# EasyEDA Pro project ProProject_FAB-O-MATIC _ a FabLab machine access control with RFID cards_2024-06-24.epro

# Schematic FAB-O-MATIC

## Sheets
1 Schematics
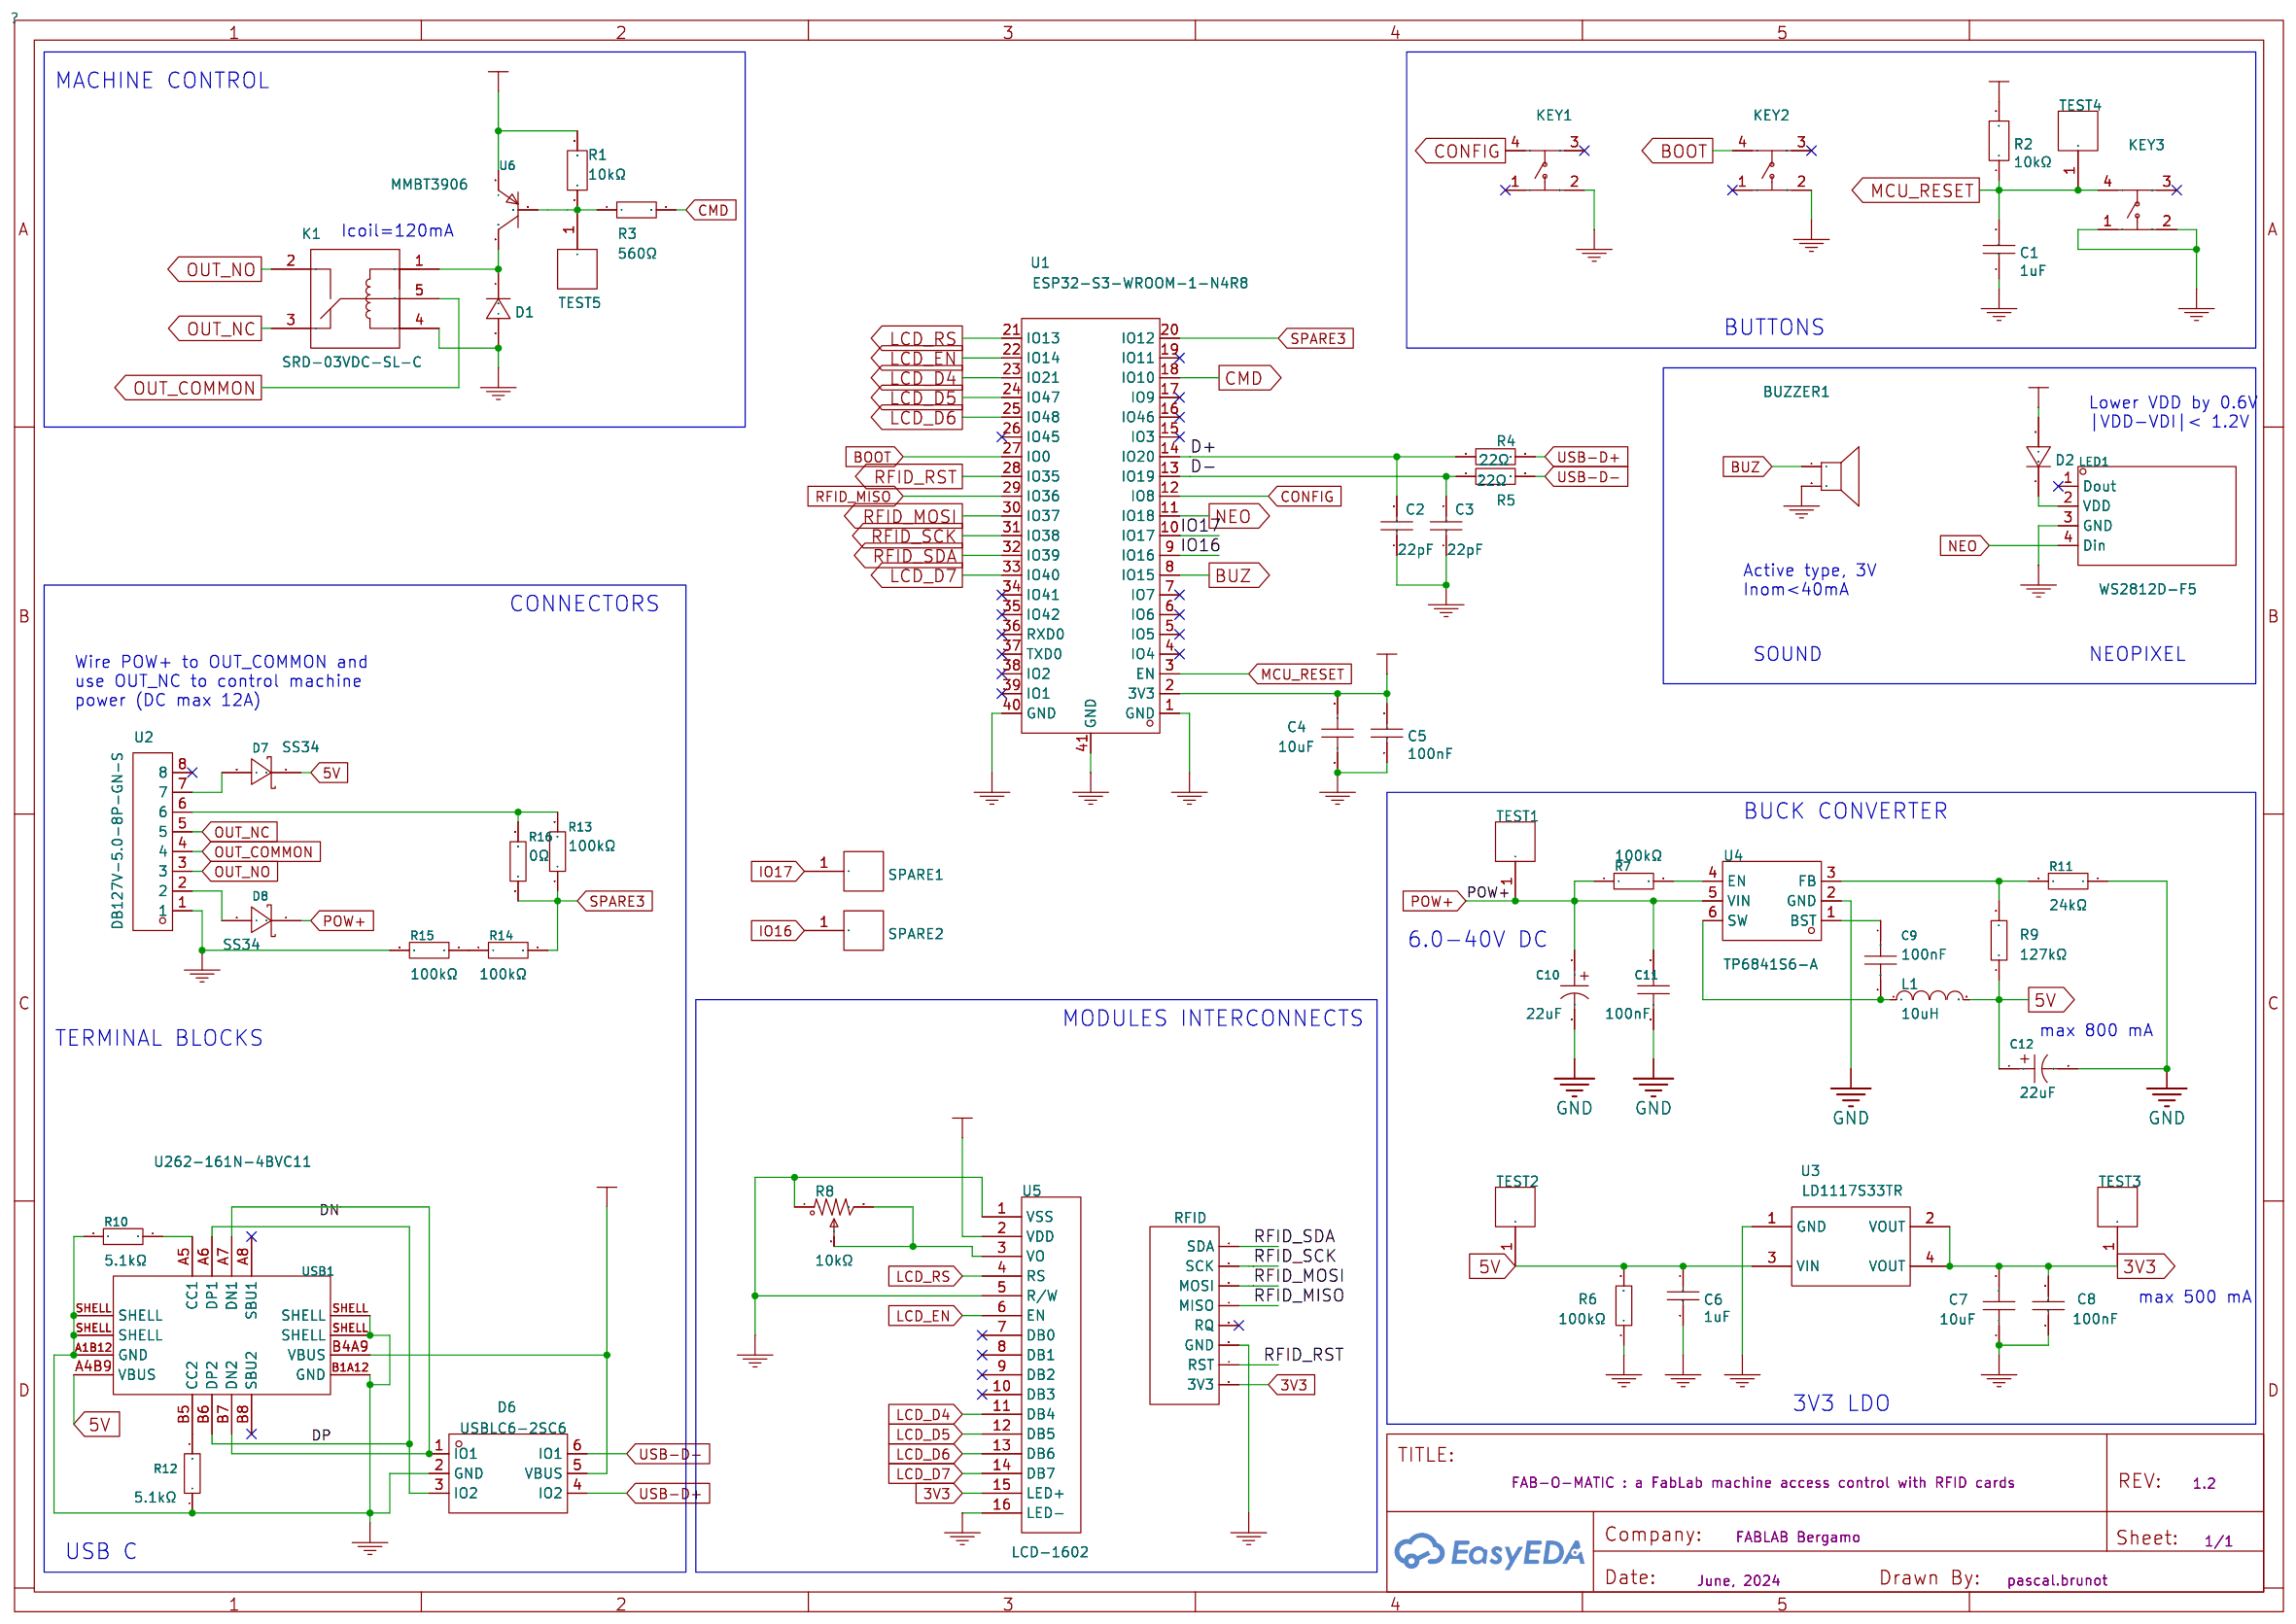
[diagram p0: Schematics]
2 Notes: Create Date: 2024-05-12; Page Name: Notes; Project Name: FAB-O-MATIC : a FabLab machine access control with RFID cards; Schematic Name: FAB-O-MATIC; Update Date: 2024-05-19; Company: FabLab BG; Drawn: PBrunot; Page Size: A4; Part Number: JLCPCB-002; Version: V0.1
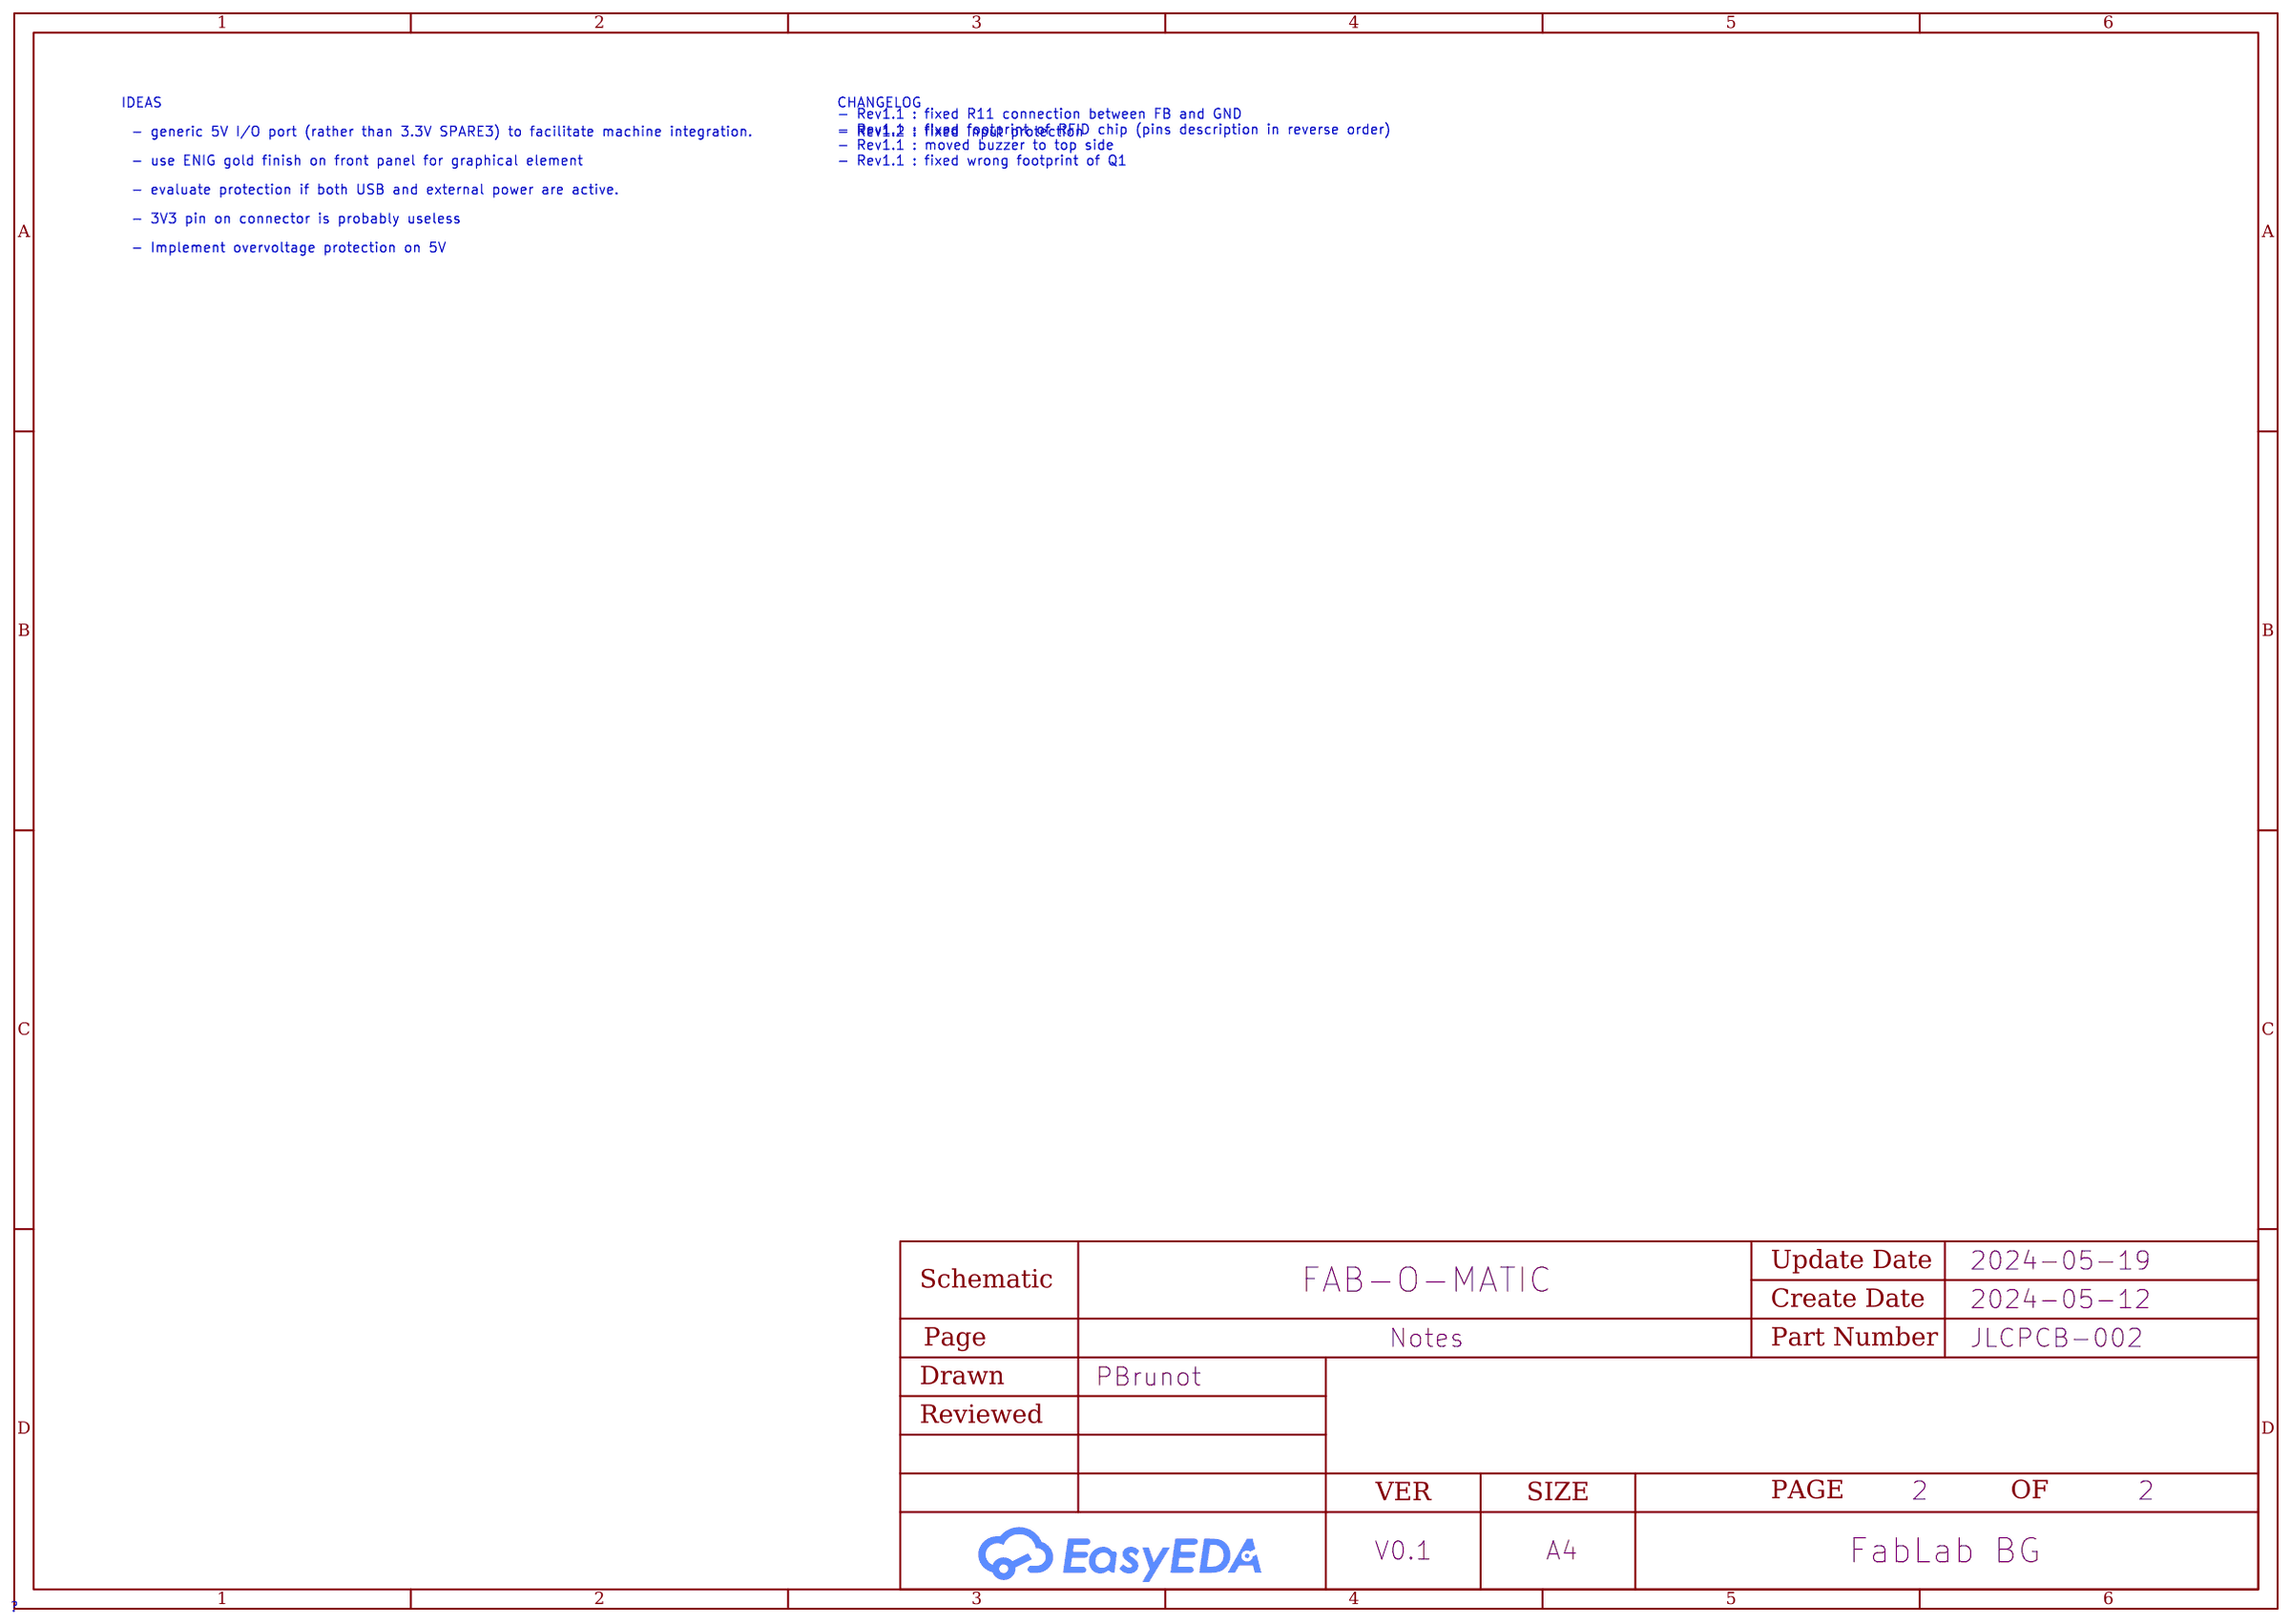
[diagram p1: Notes]

## Parts
BUZZER1  4kHz  [BUZ-TH_BD12.5-P6.50-D0.9]
C1  1uF  [C0805]
C2  22pF  [C0603]
C3  22pF  [C0603]
C4  10uF  [C0805]
C5  100nF  [C0805]
C6  1uF  [C0805]
C7  10uF  [C0805]
C8  100nF  [C0805]
C9  100nF  [C0603]
C10  22uF  [CAP-SMD_BD6.3-L6.6-W6.6-FD]
C11  100nF  [C0603]
C12  22uF  [CAP-SMD_BD6.3-L6.6-W6.6-FD]
D1  SM4007PL  [SOD-123F_L2.8-W1.8-LS3.7-RD]
D2  SM4007PL  [SOD-123F_L2.8-W1.8-LS3.7-RD]
D6  USBLC6-2SC6  [SOT-23-6_L2.9-W1.6-P0.95-LS2.8-BL]
D7  SS34  [SMA_L4.3-W2.6-LS5.2-RD]
D8  SS34  [SMA_L4.3-W2.6-LS5.2-RD]
K1  SRD-03VDC-SL-C  [RELAY-TH_SRD-03VDC-SL-C]
KEY1  TSA063G60-250  [KEY-SMD_4P-L6.1-W6.1-P4.50-LS9.0]
KEY2  TSA063G60-250  [KEY-SMD_4P-L6.1-W6.1-P4.50-LS9.0]
KEY3  TSA063G60-250  [KEY-SMD_4P-L6.1-W6.1-P4.50-LS9.0]
L1  10uH  [IND-SMD_L4.0-W4.0]
LED1  WS2812D-F5  [LED-TH_4P-BD5.8-P1.30]
P1  RFID  [footprint_17af]
R1  10kΩ  [R0805]
R2  10kΩ  [R0805]
R3  560Ω  [R0805]
R4  22Ω  [R0603]
R5  22Ω  [R0603]
R6  100kΩ  [R0805]
R7  100kΩ  [R0603]
R8  10kΩ  [RES-ADJ-TH_3362P]
R9  127kΩ  [R0603]
R10  5.1kΩ  [R0603]
R11  24kΩ  [R0603]
R12  5.1kΩ  [R0603]
R13  100kΩ  [R0603]
R14  100kΩ  [R0603]
R15  100kΩ  [R0603]
R16  0Ω  [R1206]
SPARE1  0577-0-43-80-21-27-10-0  [footprint_662d]  (no BOM)
SPARE2  0577-0-43-80-21-27-10-0  [footprint_662d]  (no BOM)
TEST1  0577-0-43-80-21-27-10-0  [footprint_662d]  (no BOM)
TEST2  0577-0-43-80-21-27-10-0  [footprint_662d]  (no BOM)
TEST3  0577-0-43-80-21-27-10-0  [footprint_662d]  (no BOM)
TEST4  0577-0-43-80-21-27-10-0  [footprint_662d]  (no BOM)
TEST5  0577-0-43-80-21-27-10-0  [footprint_662d]  (no BOM)
U1  ESP32-S3-WROOM-1-N4R8  [WIRELM-SMD_ESP32-S3-WROOM-1]
U2  DB127V-5.0-8P-GN-S  [CONN-TH_8P-P5.00_DB127V-5.0-8P-GN-S]
U3  LD1117S33TR  [SOT-223_L6.5-W3.5-P2.30-LS7.0-BR]
U4  TP6841S6-A  [SOT-23-6_L2.9-W1.6-P0.95-LS2.8-BL]
U5  LCD-1602  [footprint_8a57]
U6  MMBT3906  [SOT-23-3_L2.9-W1.3-P1.90-LS2.4-BR]
USB1  U262-161N-4BVC11  [USB-3.1-SMD_U262-161N-4BVC11]

## Library data of the parts
BUZZER1 = SFN-12055PA6.5_C360607: Oscillator Circuit:无源(外部驱动) Technology Type:压电式 Frequency:4kHz Sound Pressure Level (SPL):80dB@5V,10cm Diameter (φD):12.5mm Height:6mm; LCSC Part Name: 压电无源蜂鸣器; Supplier Part: C360607; Manufacturer: S&S(海旭); Manufacturer Part: SFN-12055PA6.5; Supplier Footprint: 插件,D=12.5mm; JLCPCB Part Class: Extended Part; Datasheet: https://atta.szlcsc.com/upload/public/pdf/source/20220225/D801AF3A55A67CFB490E002F7E7725D1.pdf; Supplier: LCSC; Oscillator Circuit: 无源(外部驱动); Technology Type: 压电式; Sound Pressure Level (SPL): 80dB@5V,10cm; Diameter (φD): 12.5mm; Height: 6mm
C1 C6 = CL21B105KBFNNNE: Capacitance: Tolerance:±10% Tolerance:±10% Voltage Rated: Temperature Coefficient:; LCSC Part Name: 1uF ±10% 50V; Supplier Part: C28323; Manufacturer: SAMSUNG(三星); Supplier Footprint: 0805; JLCPCB Part Class: Basic Part; Datasheet: https://atta.szlcsc.com/upload/public/pdf/source/20160218/1457707763339.pdf; Supplier: LCSC; Tolerance: ±10%
C2 C3 = CL10C220JB8NNNC: Capacitance: Tolerance:±5% Tolerance:±5% Voltage Rated: Temperature Coefficient:; LCSC Part Name: 22pF ±5% 50V; Supplier Part: C1653; Manufacturer: SAMSUNG(三星); Supplier Footprint: 0603; JLCPCB Part Class: Basic Part; Datasheet: https://atta.szlcsc.com/upload/public/pdf/source/20160218/1457707763339.pdf; Supplier: LCSC; Tolerance: ±5%
C4 C7 = GRM21BR61H106KE43L: Capacitance: Tolerance:±10% Tolerance:±10% Voltage Rated: Temperature Coefficient:; LCSC Part Name: 10uF ±10% 50V; Supplier Part: C440198; Manufacturer: muRata(村田); Supplier Footprint: 0805; JLCPCB Part Class: Basic Part; Datasheet: https://atta.szlcsc.com/upload/public/pdf/source/20230811/95AAE0C9AF55EDC31B7A4D8B733F534E.pdf; Supplier: LCSC; Tolerance: ±10%
C5 C8 = CL21B104KCFNNNE: Capacitance: Tolerance:±10% Tolerance:±10% Voltage Rated: Temperature Coefficient:; LCSC Part Name: 100nF ±10% 100V; Supplier Part: C28233; Manufacturer: SAMSUNG(三星); Supplier Footprint: 0805; JLCPCB Part Class: Basic Part; Datasheet: https://atta.szlcsc.com/upload/public/pdf/source/20160218/1457707763339.pdf; Supplier: LCSC; Tolerance: ±10%
C9 C11 = CC0603KRX7R9BB104: Capacitance: Tolerance:±10% Tolerance:±10% Voltage Rated: Temperature Coefficient:; LCSC Part Name: 100nF ±10% 50V; Supplier Part: C14663; Manufacturer: YAGEO(国巨); Supplier Footprint: 0603; JLCPCB Part Class: Basic Part; Datasheet: https://atta.szlcsc.com/upload/public/pdf/source/20180910/C282072_33301C7F631E79921B82A8DAC6BCC5B3.pdf; Supplier: LCSC; Tolerance: ±10%
C10 C12 = RVT22UF50V67RV0028: Capacitance: Tolerance:±20% Tolerance:±20% Rated Voltage: Ripple Current:43mA@120Hz Equivalent Series Resistance(ESR):- φD: L: Lifetime @ Temp:2000hrs@105℃ Operating Temperature:-55℃~+105℃ Operating Temperature:-55℃~+105℃; LCSC Part Name: 22uF ±20% 50V; Supplier Part: C2836438; Manufacturer: KNSCHA(科尼盛); Supplier Footprint: SMD,D6.3xL5.4mm; JLCPCB Part Class: Extended Part; Datasheet: https://atta.szlcsc.com/upload/public/pdf/source/20210528/C2836438_BFA13B3627CC6B20ADD0B3BB98082A71.pdf; Supplier: LCSC; Tolerance: ±20%; Ripple Current: 43mA@120Hz; Lifetime @ Temp: 2000hrs@105℃; Operating Temperature: -55℃~+105℃
D1 D2 = SM4007PL_C64898: Diode Configuration: Forward Voltage (Vf@If):1.1V@1A Reverse Voltage (Vr): Average Rectified Current (Io): Reverse Leakage Current:10uA@1kV; LCSC Part Name: 电压:1kV 电流:1A; Supplier Part: C64898; Manufacturer: MDD; Supplier Footprint: SOD-123FL; JLCPCB Part Class: Basic Part; Datasheet: https://atta.szlcsc.com/upload/public/pdf/source/20230823/16A8FDE162764C9B685A3717F2DA3690.pdf; Supplier: LCSC; Forward Voltage (Vf@If): 1.1V@1A; Reverse Leakage Current: 10uA@1kV
D6 = USBLC6-2SC6_C2827654: polarity:- Reverse Stand-Off Voltage (Vrwm):- Maximum Clamping Voltage:- Peak Pulse Current (Ipp)@10/1000us:- Peak Pulse Power Dissipation (Ppp)@10/1000us:- Breakdown Voltage:- Reverse Leakage Current (Ir):- Operating Temperature:- Operating Temperature:-; LCSC Part Name: ESD，可防30kV静电; Supplier Part: C2827654; Manufacturer: TECH PUBLIC(台舟); Supplier Footprint: SOT-23-6; JLCPCB Part Class: Extended Part; Datasheet: https://atta.szlcsc.com/upload/public/pdf/source/20210810/FBD75DE717D6D97BAC6DD7F2B5C09DCD.pdf; Supplier: LCSC; Type: ESD
D7 D8 = SS34_C8678: Diode Configuration:Single Forward Voltage (Vf@If):550mV@3A Reverse Voltage (Vr):40V Average Rectified Current (Io):3A Reverse Leakage Current (Ir):500uA@40V; LCSC Part Name: 电压:40V 电流:3A; Supplier Part: C8678; Manufacturer: MDD; Supplier Footprint: SMA(DO-214AC); JLCPCB Part Class: Basic Part; Datasheet: https://atta.szlcsc.com/upload/public/pdf/source/20230314/A80AE34493C69B89E2F4B1712F433538.pdf; Supplier: LCSC; Diode Configuration: Single; Forward Voltage (Vf@If): 550mV@3A; Reverse Voltage (Vr): 40V; Average Rectified Current (Io): 3A; Reverse Leakage Current (Ir): 500uA@40V
K1 = SRD-03VDC-SL-C: Coil Voltage:3V Contact Form:一组转换:1C(SPDT-转换) Pin Number:5 Contact Rating:- Maximum Switching Voltage:250V@AC Coil Rated Power:360mW Maximum Switching Current:15A Coil Type:无极性-单线圈 Contact Resistance:100mΩ Operate Time:10ms Release Time:10ms; LCSC Part Name: 3V继电器 单刀双掷 蓝色; Supplier Part: C496430; Manufacturer: 松乐; Supplier Footprint: 插件,15.6x19.2mm; JLCPCB Part Class: Extended Part; Datasheet: https://atta.szlcsc.com/upload/public/pdf/source/20211029/0AF1F09028F3938DCCE87F54F358E4BA.pdf; Supplier: LCSC; Coil Voltage: 3V; Contact Form: 一组转换:1C(SPDT-转换); Pin Number: 5; Maximum Switching Voltage: 250V@AC; Coil Rated Power: 360mW; Maximum Switching Current: 15A; Coil Type: 无极性-单线圈; Contact Resistance: 100mΩ; Operate Time: 10ms; Release Time: 10ms
KEY1-KEY3 = TSA063G60-250: Circuit:SPST Actuator Style:Round Button Operating Force:250gf Mounting Style:Brick nogging Switch Length:6.1mm Switch Width:6.1mm Switch Height:6mm Strike Gundam:不带 Contact Current:50mA Voltage Rating (DC):12V Insulation Resistance:100MΩ Actuator/Cap Col; LCSC Part Name: 6.1*6.1*6mm 立贴 轻触开关; Supplier Part: C294566; Manufacturer: BRIGHT(博瑞泰); Supplier Footprint: SMD; JLCPCB Part Class: Extended Part; Datasheet: https://atta.szlcsc.com/upload/public/pdf/source/20181029/C294570_15EFF1F4D215547575AD6307D8A439BB.pdf; Supplier: LCSC; Circuit: SPST; Actuator Style: Round Button; Operating Force: 250gf; Mounting Style: Brick nogging; Switch Length: 6.1mm; Switch Width: 6.1mm; Switch Height: 6mm; Strike Gundam: 不带; Contact Current: 50mA; Voltage Rating (DC): 12V; Insulation Resistance: 100MΩ; Actuator/Cap Color: Black; With Lamp: No; Pin Style: Gull Wing; Mechanical Life: 5万次; Operating Temperature: -25℃~+70℃
L1 = SWPA4030S100MT: Inductance: Tolerance:±20% Tolerance:±20% Rated Current: Saturation Current (Isat):2.4A DC Resistance (DCR): Type:- Ratings:-; LCSC Part Name: 10uH ±20% 2.4A; Supplier Part: C38117; Manufacturer: Sunlord(顺络); Supplier Footprint: SMD; JLCPCB Part Class: Extended Part; Datasheet: https://atta.szlcsc.com/upload/public/pdf/source/20231024/317626D2AA2F8AB4113C1875E432E6E1.pdf; Supplier: LCSC; Tolerance: ±20%; Saturation Current (Isat): 2.4A
LED1 = WS2812D-F5: Lamp Holder Type:5mm圆形灯头; Supplier Part: C190565; Manufacturer: worldsemi; Supplier Footprint: 插件,D=5mm; JLCPCB Part Class: Extended Part; Datasheet: https://atta.szlcsc.com/upload/public/pdf/source/20220418/4832EF9FB0C1B68C1F4176435955B165.pdf; Supplier: LCSC; Lamp Holder Type: 5mm圆形灯头
P1 = RFID: Supplier Part: C27438; Supplier: LCSC; Manufacturer: BOOMELE; Manufacturer Part: Female headerHDR1X8-2.54
R1 R2 = 0805W8F1002T5E: Type:Thick Film Resistors Resistance:10kΩ Tolerance:±1% Tolerance:±1% Power(Watts): Overload Voltage (Max): Temperature Coefficient:±100ppm/℃ Temperature Coefficient:±100ppm/℃ Operating Temperature Range:-55℃~+155℃ Operating Temperature Range:-55℃~+155℃; LCSC Part Name: 10kΩ ±1% 125mW 厚膜电阻; Supplier Part: C17414; Manufacturer: UNI-ROYAL(厚声); Supplier Footprint: 0805; JLCPCB Part Class: Basic Part; Datasheet: https://atta.szlcsc.com/upload/public/pdf/source/20200306/C422600_1E6D84923E4A46A82E41ADD87F860B5C.pdf; Supplier: LCSC; Type: Thick Film Resistors; Tolerance: ±1%; Temperature Coefficient: ±100ppm/℃; Operating Temperature Range: -55℃~+155℃
R3 = 0805W8F5600T5E: Type:Thick Film Resistors Resistance: Tolerance:±1% Tolerance:±1% Power(Watts): Overload Voltage (Max): Temperature Coefficient:±100ppm/℃ Temperature Coefficient:±100ppm/℃ Operating Temperature Range:-55℃~+155℃ Operating Temperature Range:-55℃~+155℃; LCSC Part Name: 560Ω ±1% 125mW 厚膜电阻; Supplier Part: C28636; Manufacturer: UNI-ROYAL(厚声); Supplier Footprint: 0805; JLCPCB Part Class: Basic Part; Datasheet: https://atta.szlcsc.com/upload/public/pdf/source/20200306/C422600_1E6D84923E4A46A82E41ADD87F860B5C.pdf; Supplier: LCSC; Type: Thick Film Resistors; Tolerance: ±1%; Temperature Coefficient: ±100ppm/℃; Operating Temperature Range: -55℃~+155℃
R4 R5 = 0603WAF220JT5E: Type:Thick Film Resistors Resistance:22Ω Tolerance:±1% Tolerance:±1% Power(Watts): Overload Voltage (Max): Temperature Coefficient:±100ppm/℃ Temperature Coefficient:±100ppm/℃ Operating Temperature Range:-55℃~+155℃ Operating Temperature Range:-55℃~+155℃; LCSC Part Name: 22Ω ±1% 100mW 厚膜电阻; Supplier Part: C23345; Manufacturer: UNI-ROYAL(厚声); Supplier Footprint: 0603; JLCPCB Part Class: Basic Part; Datasheet: https://atta.szlcsc.com/upload/public/pdf/source/20200306/C422600_1E6D84923E4A46A82E41ADD87F860B5C.pdf; Supplier: LCSC; Type: Thick Film Resistors; Tolerance: ±1%; Temperature Coefficient: ±100ppm/℃; Operating Temperature Range: -55℃~+155℃; Resistance: 22
R6 = 0805W8F1003T5E: Type:Thick Film Resistors Resistance:100kΩ Tolerance:±1% Tolerance:±1% Power(Watts): Overload Voltage (Max): Temperature Coefficient:±100ppm/℃ Temperature Coefficient:±100ppm/℃ Operating Temperature Range:-55℃~+155℃ Operating Temperature Range:-55℃~+155℃; LCSC Part Name: 100kΩ ±1% 125mW 厚膜电阻; Supplier Part: C149504; Manufacturer: UNI-ROYAL(厚声); Supplier Footprint: 0805; JLCPCB Part Class: Basic Part; Datasheet: https://atta.szlcsc.com/upload/public/pdf/source/20200306/C422600_1E6D84923E4A46A82E41ADD87F860B5C.pdf; Supplier: LCSC; Type: Thick Film Resistors; Tolerance: ±1%; Temperature Coefficient: ±100ppm/℃; Operating Temperature Range: -55℃~+155℃
R7 R13-R15 = 0603WAF1003T5E: Type:Thick Film Resistors Resistance:100kΩ Tolerance:±1% Tolerance:±1% Power(Watts): Overload Voltage (Max): Temperature Coefficient:±100ppm/℃ Temperature Coefficient:±100ppm/℃ Operating Temperature Range:-55℃~+155℃ Operating Temperature Range:-55℃~+155℃; LCSC Part Name: 100kΩ ±1% 100mW 厚膜电阻; Supplier Part: C25803; Manufacturer: UNI-ROYAL(厚声); Supplier Footprint: 0603; JLCPCB Part Class: Basic Part; Datasheet: https://atta.szlcsc.com/upload/public/pdf/source/20200306/C422600_1E6D84923E4A46A82E41ADD87F860B5C.pdf; Supplier: LCSC; Type: Thick Film Resistors; Tolerance: ±1%; Temperature Coefficient: ±100ppm/℃; Operating Temperature Range: -55℃~+155℃
R8 = 3362P-1-103_C118956: Resistance: Tolerance:±10% Tolerance:±10%; LCSC Part Name: 10kΩ ±10%; Supplier Part: C118956; Manufacturer: BOCHEN(博晨); Manufacturer Part: 3362P-1-103; Supplier Footprint: 插件; JLCPCB Part Class: Extended Part; Datasheet: https://atta.szlcsc.com/upload/public/pdf/source/20171114/C118956_15106326650691117445.pdf; Supplier: LCSC; Tolerance: ±10%
R9 = RC0603FR-07127KL: Type:Thick Film Resistors Resistance: Tolerance:±1% Tolerance:±1% Power(Watts): Overload Voltage (Max): Temperature Coefficient:±100ppm/℃ Temperature Coefficient:±100ppm/℃ Operating Temperature Range:-55℃~+155℃ Operating Temperature Range:-55℃~+155℃; LCSC Part Name: 厚膜电阻 127kΩ ±1% 100mW; Supplier Part: C245905; Manufacturer: YAGEO(国巨); Supplier Footprint: 0603; JLCPCB Part Class: Extended Part; Datasheet: https://atta.szlcsc.com/upload/public/pdf/source/20181031/C326976_E9901E35333D136A19B6CE377E889A82.pdf; Supplier: LCSC; Type: Thick Film Resistors; Tolerance: ±1%; Temperature Coefficient: ±100ppm/℃; Operating Temperature Range: -55℃~+155℃
R10 R12 = 0603WAF5101T5E: Type:Thick Film Resistors Resistance:5.1kΩ Tolerance:±1% Tolerance:±1% Power(Watts): Overload Voltage (Max): Temperature Coefficient:±100ppm/℃ Temperature Coefficient:±100ppm/℃ Operating Temperature Range:-55℃~+155℃ Operating Temperature Range:-55℃~+155℃; LCSC Part Name: 5.1kΩ ±1% 100mW 厚膜电阻; Supplier Part: C23186; Manufacturer: UNI-ROYAL(厚声); Supplier Footprint: 0603; JLCPCB Part Class: Basic Part; Datasheet: https://atta.szlcsc.com/upload/public/pdf/source/20200306/C422600_1E6D84923E4A46A82E41ADD87F860B5C.pdf; Supplier: LCSC; Type: Thick Film Resistors; Tolerance: ±1%; Temperature Coefficient: ±100ppm/℃; Operating Temperature Range: -55℃~+155℃
R11 = 0603WAF2402T5E: Type:Thick Film Resistors Resistance:24kΩ Tolerance:±1% Tolerance:±1% Power(Watts): Overload Voltage (Max): Temperature Coefficient:±100ppm/℃ Temperature Coefficient:±100ppm/℃ Operating Temperature Range:-55℃~+155℃ Operating Temperature Range:-55℃~+155℃; LCSC Part Name: 24kΩ ±1% 100mW 厚膜电阻; Supplier Part: C23352; Manufacturer: UNI-ROYAL(厚声); Supplier Footprint: 0603; JLCPCB Part Class: Basic Part; Datasheet: https://atta.szlcsc.com/upload/public/pdf/source/20200306/C422600_1E6D84923E4A46A82E41ADD87F860B5C.pdf; Supplier: LCSC; Type: Thick Film Resistors; Tolerance: ±1%; Temperature Coefficient: ±100ppm/℃; Operating Temperature Range: -55℃~+155℃
R16 = 1206W4F0000T5E: Type:Thick Film Resistors Resistance: Tolerance:±1% Tolerance:±1% Power(Watts): Overload Voltage (Max): Temperature Coefficient:±800ppm/℃ Temperature Coefficient:±800ppm/℃ Operating Temperature Range:-55℃~+155℃ Operating Temperature Range:-55℃~+155℃; LCSC Part Name: 0Ω ±1% 250mW 厚膜电阻; Supplier Part: C17888; Manufacturer: UNI-ROYAL(厚声); Supplier Footprint: 1206; JLCPCB Part Class: Basic Part; Datasheet: https://atta.szlcsc.com/upload/public/pdf/source/20200306/C422600_1E6D84923E4A46A82E41ADD87F860B5C.pdf; Supplier: LCSC; Type: Thick Film Resistors; Tolerance: ±1%; Temperature Coefficient: ±800ppm/℃; Operating Temperature Range: -55℃~+155℃
SPARE1 SPARE2 TEST1-TEST5 = 0577-0-43-80-21-27-10-0: Supplier: LCSC; Supplier Part: C2895400; Manufacturer: null; JLCPCB Part Class: Extended Part
U1 = ESP32-S3-WROOM-1-N4R8: LCSC Part Name: 通用型Wi-Fi+低功耗蓝牙MCU模组; Supplier Part: C2913200; Manufacturer: ESPRESSIF(乐鑫); Supplier Footprint: SMD,18x25.5mm; JLCPCB Part Class: Extended Part; Datasheet: https://atta.szlcsc.com/upload/public/pdf/source/20220628/A2AC12B3C87735CAEB7EBE2DBE80936C.pdf; Supplier: LCSC; spicePre: U
U2 = DB127V-5.0-8P-GN-S: Structure:1x8P Pitch:5mm Color:Green Mounting Style:Straight Current Rating (Max):15A Voltage Rating (Max):250V Number of Pins:8P Number of Rows:1 Wire Gauge - AWG:14~26 Wire Gauge - AWG:14~26 Wire Gauge - mm2:1.5 Wire Gauge - mm2:1.5 Number of PINs Per R; LCSC Part Name: 5mm 1x8P 排数:1 每排P数:8 直插; Supplier Part: C430626; Manufacturer: DORABO(地博电气); Supplier Footprint: 插件,P=5mm; JLCPCB Part Class: Extended Part; Datasheet: https://atta.szlcsc.com/upload/public/pdf/source/20230106/9CDB472D403F670588C42D375AEF1B30.pdf; Supplier: LCSC; Structure: 1x8P; Pitch: 5mm; Color: Green; Mounting Style: Straight; Current Rating (Max): 15A; Voltage Rating (Max): 250V; Number of Pins: 8P; Number of Rows: 1; Wire Gauge - AWG: 14~26; Wire Gauge - mm2: 1.5; Number of PINs Per Row: 8; Operating Temperature Range: -40℃~+105℃
U3 = LD1117S33TR: Output Type: Maximum Input Voltage:15V Output Voltage:3.3V Output Voltage:3.3V MAX Output Current:800mA Power Supply Rejection Ratio (PSRR):75dB@(120Hz) Dropout Voltage:1.2V@(800mA) standby current:10mA Operating Temperature:0℃~+125℃ Operating Temperature; LCSC Part Name: 输入15V 输出3.3V 800mA; Supplier Part: C86781; Manufacturer: ST(意法半导体); Supplier Footprint: SOT-223; JLCPCB Part Class: Extended Part; Datasheet: https://atta.szlcsc.com/upload/public/pdf/source/20181022/C283467_00098992BB1D287195B66486CE33A2DD.pdf; Supplier: LCSC; Maximum Input Voltage: 15V; Output Voltage: 3.3V; MAX Output Current: 800mA; Power Supply Rejection Ratio (PSRR): 75dB@(120Hz); Dropout Voltage: 1.2V@(800mA); standby current: 10mA; Operating Temperature: 0℃~+125℃; Output Polarity: Positive electrode; Number of Outputs: 1
U4 = TP6841S6-A: Supplier Part: C2844924; Manufacturer: TECH PUBLIC(台舟); Supplier Footprint: SOT-23-6; JLCPCB Part Class: Extended Part; Datasheet: https://atta.szlcsc.com/upload/public/pdf/source/20210709/C2844924_E200F0B809810750A1B5AEDD4B4FD840.pdf; Supplier: LCSC
U5 = LCD-1602: Manufacturer Part: ?
U6 = MMBT3906_C7420354: Transistor Type:PNP Collector Current (Ic):200mA Collector-Emitter Breakdown Voltage (Vceo):40V Power Dissipation (Pd): DC Current Gain (hFE@Ic,Vce):100@10mA,1.0V DC Current Gain (hFE@Ic,Vce):100@10mA,1.0V Transition Frequency (fT):300MHz Collector Cut-Of; LCSC Part Name: 耐压:40V 电流:200mA PNP; Supplier Part: C7420354; Manufacturer: 宏迦橙; Supplier Footprint: SOT-23; JLCPCB Part Class: Extended Part; Datasheet: https://atta.szlcsc.com/upload/public/pdf/source/20231222/C57AF7F09D8B4437DE7730975D81C46C.pdf; Supplier: LCSC; Transistor Type: PNP; Collector Current (Ic): 200mA; Collector-Emitter Breakdown Voltage (Vceo): 40V; DC Current Gain (hFE@Ic,Vce): 100@10mA,1.0V; Transition Frequency (fT): 300MHz; Collector Cut-Off Current (Icbo): 100nA; Collector-Emitter Saturation Voltage (VCE(sat)@Ic,Ib): 300mV@50mA,5.0mA; Operating Temperature: -55℃~+150℃
USB1 = U262-161N-4BVC11: Connector Type:Type-C Standard:USB 3.1 Gender:Female Number of Ports:1 Number of Contacts:16P Mounting Style:卧贴 Current Rating - Power (Max):3A Contact Material:Copper Alloy Contact Plating:Gold Operating Temperature Range:-40℃~+85℃ Operating Temperature; LCSC Part Name: Type-C 母 卧贴; Supplier Part: C319148; Manufacturer: XKB Connectivity(中国星坤); Supplier Footprint: SMD; JLCPCB Part Class: Extended Part; Datasheet: https://atta.szlcsc.com/upload/public/pdf/source/20211015/B478CBA0F1623DA36A6CC6918C49C838.pdf; Supplier: LCSC; Connector Type: Type-C; Standard: USB 3.1; Gender: Female; Number of Ports: 1; Number of Contacts: 16P; Mounting Style: 卧贴; Current Rating - Power (Max): 3A; Contact Material: Copper Alloy; Contact Plating: Gold; Operating Temperature Range: -40℃~+85℃; Soldering Temperature(Max): 260℃

## Nets
3V3: C4.2 C5.2 C7.2 C8.2 P1.8(3V3) R1.2 R2.2 TEST3.1 U1.2(3V3) U3.2(VOUT) U3.4(VOUT) U5.15(LED+) U6.2(E)
5V: C6.1 C12.1 D2.2(A) D6.5(VBUS) D7.1(K) L1.2 R6.2 R9.1 TEST2.1 U3.3(VIN) U5.2(VDD) USB1.A4B9(VBUS) USB1.B4A9(VBUS)
GND: BUZZER1.2 C1.1 C2.1 C3.1 C4.1 C5.1 C6.2 C7.1 C8.1 C10.2 C11.1 C12.2 D1.2(A) D6.2(GND) K1.4 KEY1.2 KEY2.2 KEY3.1 KEY3.2 LED1.3(GND) P1.6(GND) R6.1 R8.1 R10.2 R11.1 R12.1 R15.2 U1.1(GND) U1.40(GND) U1.41(GND) U2.1 U3.1(GND) U4.2(GND) U5.1(VSS) U5.5(R/W) U5.16(LED-) USB1.A1B12(GND) USB1.B1A12(GND) USB1.SHELL
BOOT: KEY2.4 U1.27(IO0)
BUZ: BUZZER1.1 U1.8(IO15)
CMD: R3.2 U1.18(IO10)
CONFIG: KEY1.4 U1.12(IO8)
D+: C2.2 R4.1 U1.14(IO20)
D-: C3.2 R5.1 U1.13(IO19)
DN: D6.1(IO1) USB1.A7(DN1) USB1.B7(DN2)
DP: D6.3(IO2) USB1.A6(DP1) USB1.B6(DP2)
IO16: SPARE2.1 U1.9(IO16)
IO17: SPARE1.1 U1.10(IO17)
LCD_D4: U1.23(IO21) U5.11(DB4)
LCD_D5: U1.24(IO47) U5.12(DB5)
LCD_D6: U1.25(IO48) U5.13(DB6)
LCD_D7: U1.33(IO40) U5.14(DB7)
LCD_EN: U1.22(IO14) U5.6(EN)
LCD_RS: U1.21(IO13) U5.4(RS)
MCU_RESET: C1.2 KEY3.4 R2.1 TEST4.1 U1.3(EN)
NEO: LED1.4(Din) U1.11(IO18)
OUT_COMMON: K1.5 U2.4
OUT_NC: K1.3 U2.5
OUT_NO: K1.2 U2.3
POW+: C10.1 C11.2 D8.1(K) R7.1 TEST1.1 U4.5(VIN)
RFID_MISO: P1.4(MISO) U1.29(IO36)
RFID_MOSI: P1.3(MOSI) U1.30(IO37)
RFID_RST: P1.7(RST) U1.28(IO35)
RFID_SCK: P1.2(SCK) U1.31(IO38)
RFID_SDA: P1.1(SDA) U1.32(IO39)
SPARE3: R13.1 R14.2 R16.1 U1.20(IO12)
USB-D+: D6.4(IO2) R4.2
USB-D-: D6.6(IO1) R5.2
$1N85: D1.1(C) K1.1 U6.3(C)
$1N86: R1.1 R3.1 TEST5.1 U6.1(B)
$1N90: D2.1(C) LED1.2(VDD)
$1N15737: C9.1 U4.1(BST)
$1N15956: R7.2 U4.4(EN)
$1N24952: R12.2 USB1.B5(CC2)
$1N25390: R10.1 USB1.A5(CC1)
$1N26975: R8.2 R8.3 U5.3(VO)
$1N52138: C9.2 L1.1 U4.6(SW)
$1N52395: R9.2 R11.2 U4.3(FB)
$1N56060: R13.2 R16.2 U2.6
$1N59600: R14.1 R15.1
$1N59649: D7.2(A) U2.7
$1N59700: D8.2(A) U2.2

Not connected (* = marked no-connect by the designer): KEY1 1* 3*; KEY2 1* 3*; KEY3 3*; LED1 1(Dout)*; P1 5(RQ)*; U1 4(IO4)* 5(IO5)* 6(IO6)* 7(IO7)* 15(IO3)* 16(IO46)* 17(IO9)* 19(IO11)* 26(IO45)* 34(IO41)* 35(IO42)* 36(RXD0)* 37(TXD0)* 38(IO2)* 39(IO1)*; U2 8*; U5 7(DB0)* 8(DB1)* 9(DB2)* 10(DB3)*; USB1 A8(SBU1)* B8(SBU2)*

## Notes on the sheets
sheet 1
- MACHINE CONTROL
- Icoil=120mA
- BUTTONS
- Lower VDD by 0.6V
  |VDD-VDI|< 1.2V
- Active type, 3V
  Inom<40mA
- CONNECTORS
- Wire POW+ to OUT_COMMON and
  use OUT_NC to control machine
  power (DC max 12A)
- SOUND
- NEOPIXEL
- BUCK CONVERTER
- 6.0-40V DC
- MODULES INTERCONNECTS
- TERMINAL BLOCKS
- max 800 mA
- max 500 mA
- 3V3 LDO
- USB C
sheet 2
- IDEAS
- CHANGELOG
- - generic 5V I/O port (rather than 3.3V SPARE3) to facilitate machine integration.
- - Rev1.2 : fixed input protection
- - use ENIG gold finish on front panel for graphical element
- - Rev1.1 : fixed R11 connection between FB and GND
  - Rev1.1 : fixed footprint of RFID chip (pins description in reverse order)
  - Rev1.1 : moved buzzer to top side
  - Rev1.1 : fixed wrong footprint of Q1
- - evaluate protection if both USB and external power are active.
- - 3V3 pin on connector is probably useless
- - Implement overvoltage protection on 5V

# Board COLOR Front panel
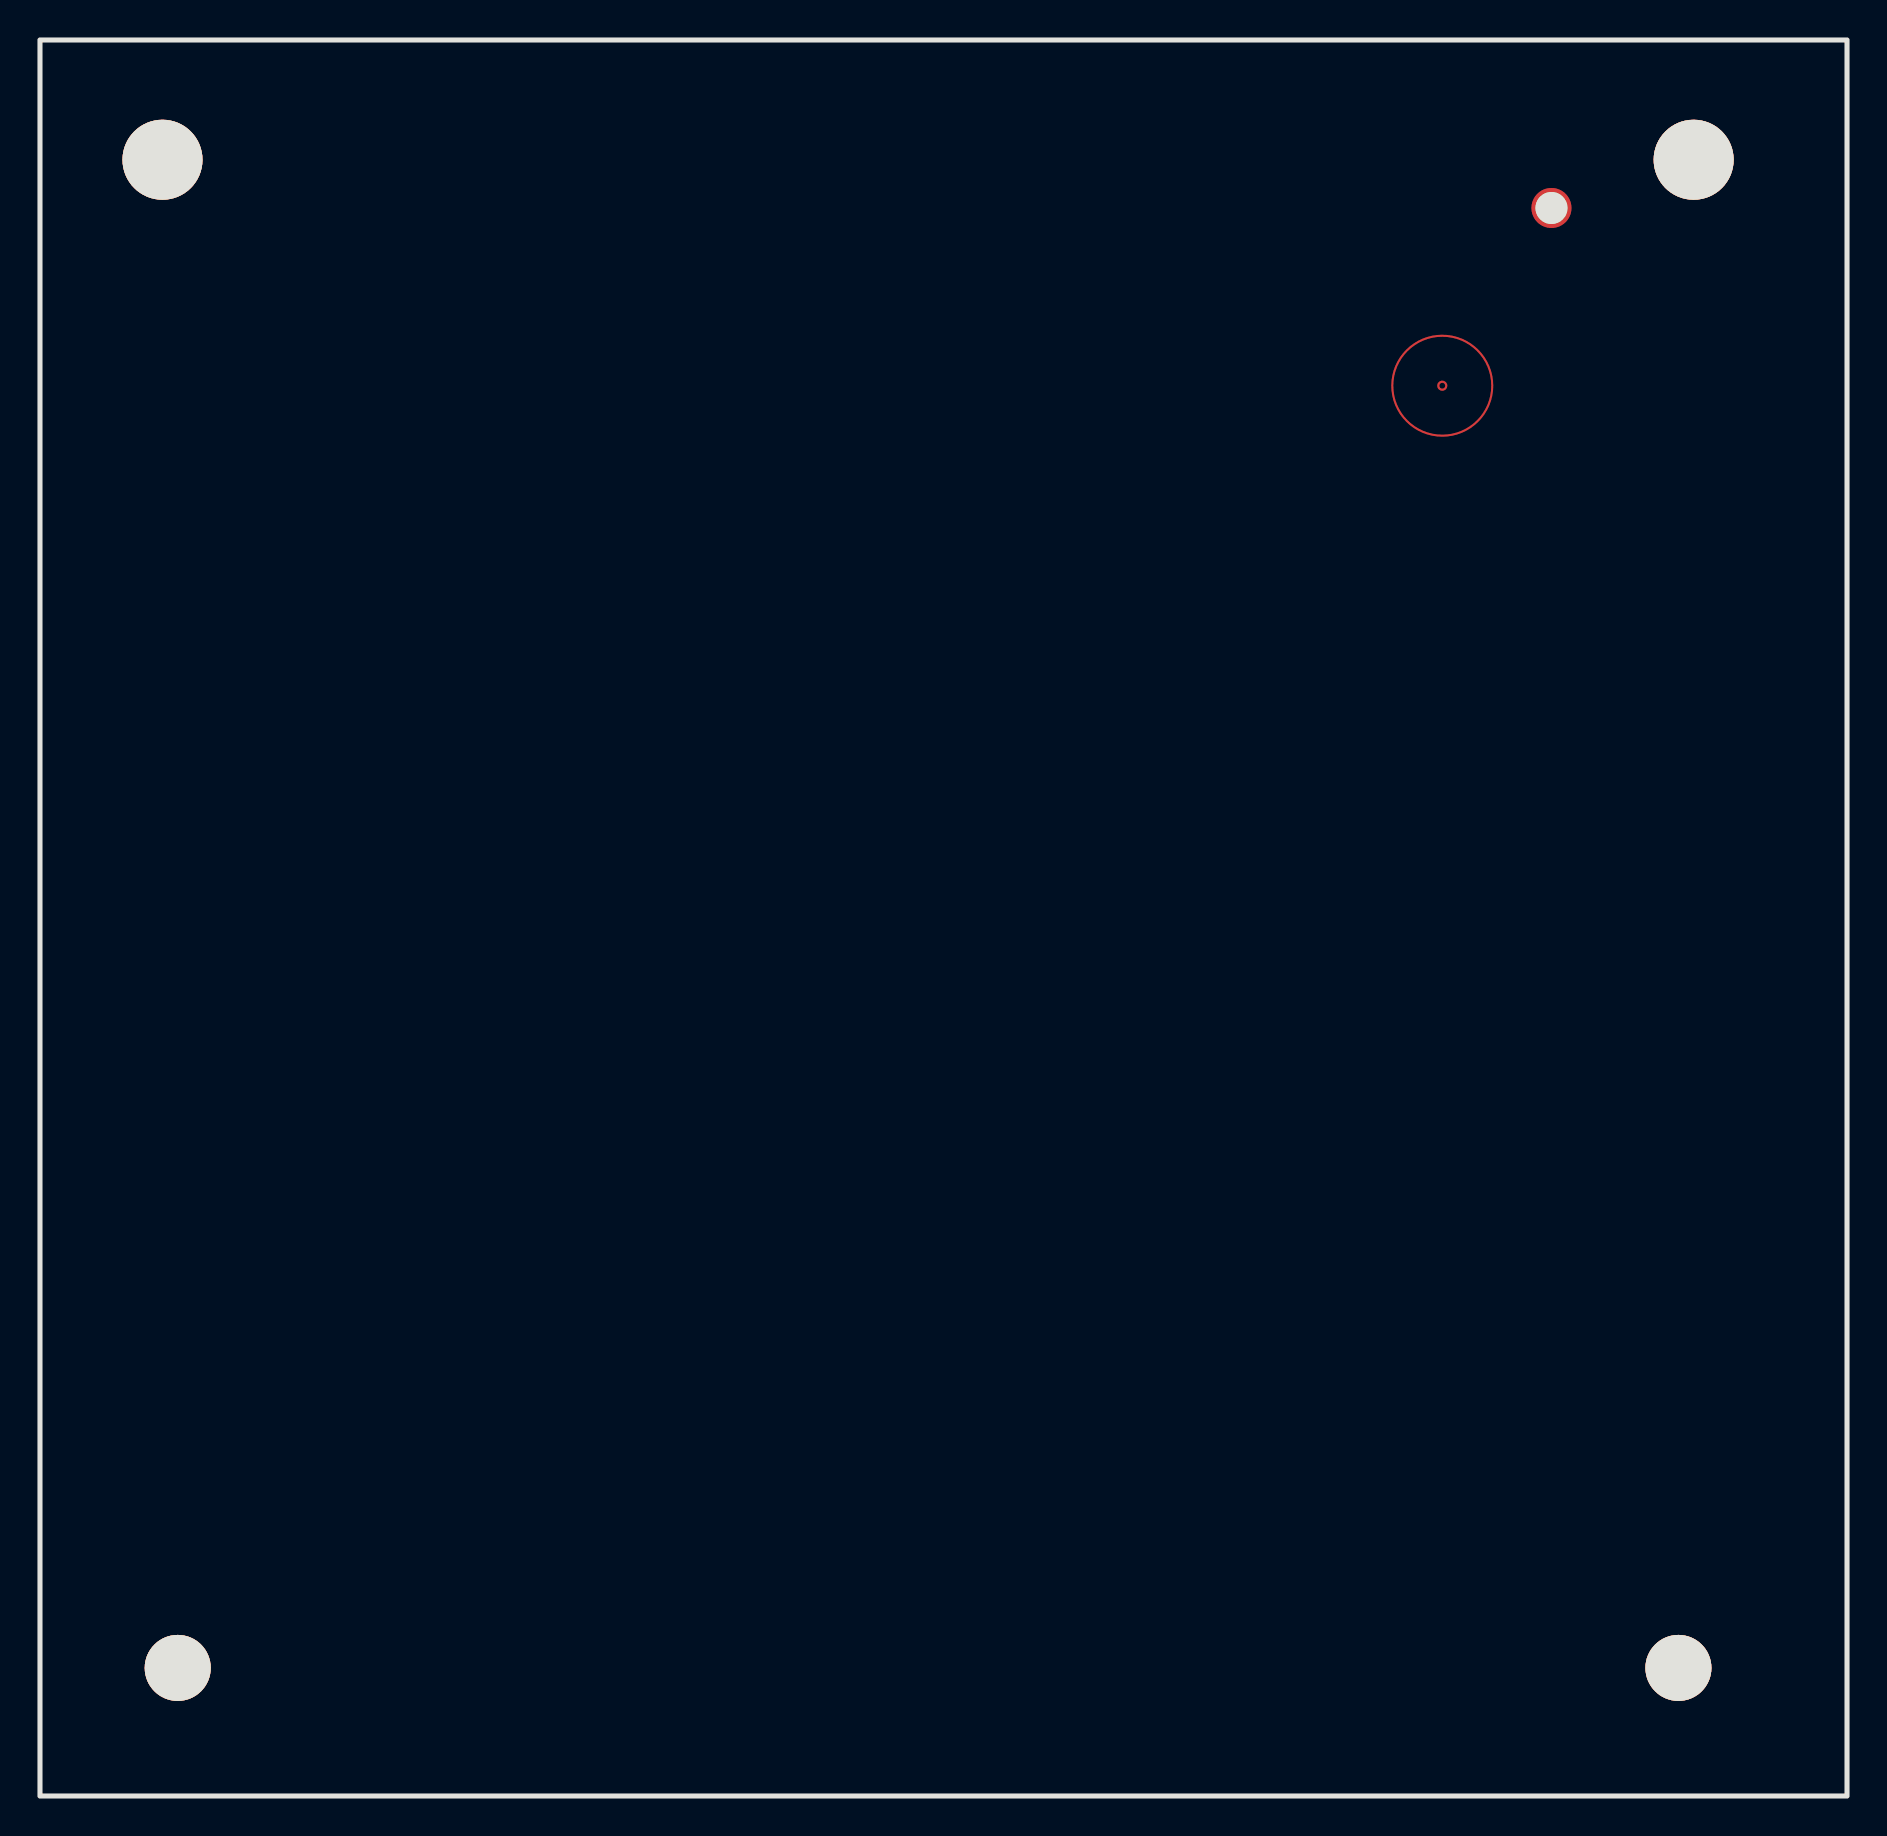
[diagram p2: board, top side]
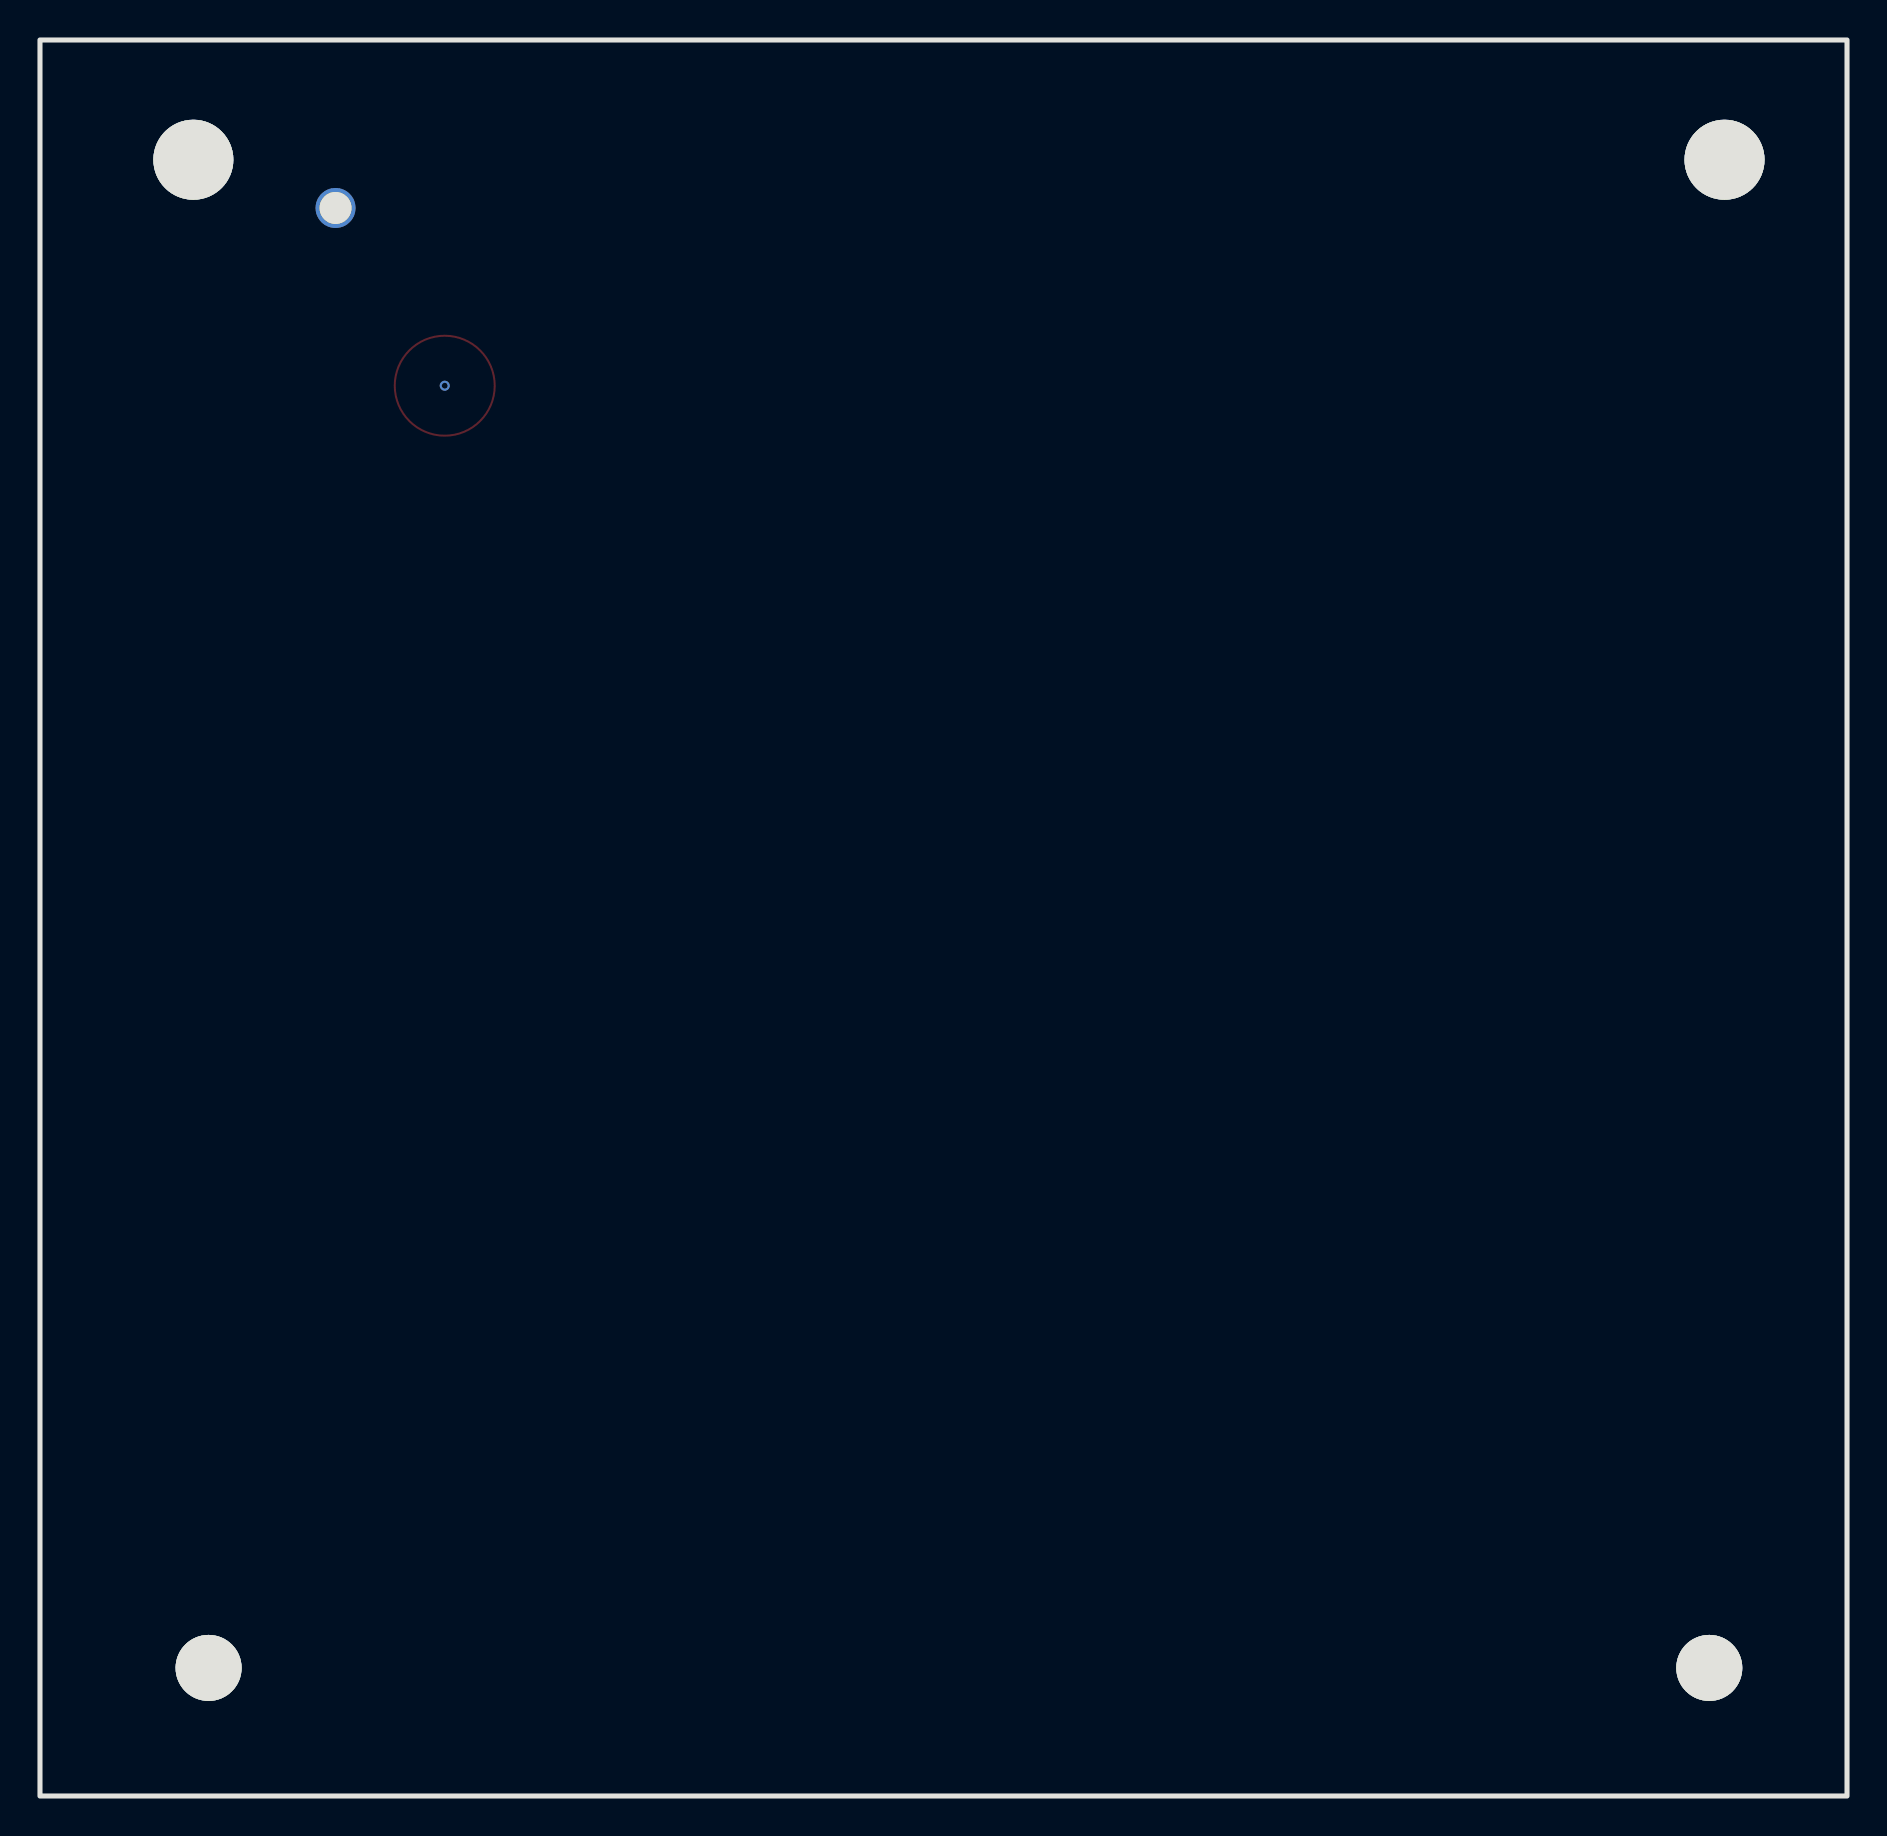
[diagram p3: board, bottom side, seen from below]

Outline 90.38 x 87.84 mm; copper layers: Top Layer, Bottom Layer. Coordinates in mm from the lower left corner of the outline.
Outline path: rectangle 0,87.84 90.38,0
Stack: Top Layer 0.035mm / Dielectric1 1.51mm FR4 er 4.5 / Bottom Layer 0.035mm

## Design rules (mm)
template: JLCPCB Capability(Two Layers Board)
spacing copperThickness1oz (default): track to track 0.102, other pairs 0.152 to 0.3
spacing copperThickness2oz: track to track 0.203, other pairs 0.152 to 0.3
track width copperThickness1oz (default): min 0.127, default 0.254, max 2.54
track width copperThickness2oz: min 0.203, default 0.254, max 2.54
differential pair differentialPair (default): width min 0.127, default 0.254, max 2.54; gap min 0.152, default 0.152
via viaSize (default): diameter min 0.5, default 0.61, max 10; hole min 0.3, default 0.305, max 6.3

## Placement (name value [footprint] x y rotation side)
NOREF  -  [Pad_e115]  6.13 81.85 0 top
NOREF#2  -  [Pad_e116]  81.95 6.41 0 top
NOREF#3  -  [Pad_e117]  6.89 6.41 0 top
NOREF#4  -  [Pad_e114]  82.71 81.85 0 top
NOREF#5  -  [Pad_e74]  75.6 79.43 0 top

## Footprints (pads in the part's own frame, mm; a bottom-side part is the same pattern mirrored in y, then rotated)
Pad_e74
  round 2 hole 1.6: 1(0,0)
Pad_e114
  round 4 hole 4: 1(0,0)
Pad_e115
  round 4 hole 4: 1(0,0)
Pad_e116
  round 3.3 hole 3.3: 1(0,0)
Pad_e117
  round 3.3 hole 3.3: 1(0,0)

## Nets

Pads without a net: NOREF 1; NOREF#2 1; NOREF#3 1; NOREF#4 1; NOREF#5 1

## Via types
v1: diameter 0.5, hole 0.3, Top Layer to Bottom Layer, 1 via

## Routing (per net, layer and track width the routed paths; a pad name or vN(x,y) marks a point on that pad's centre or on a via; arc(x,y) is an arc through that point)
(no net):
  vias: v1(70.14,70.54)

## Text on the board
Document Layer: Changelog: / - 24/04 removed copper area to avoid RFID shielding / - 04/05 removed holes for buzzer and neopixel, added transparent area / - 19/05 enlarged reset hole 1.6mm

# Board PCB REV1.2
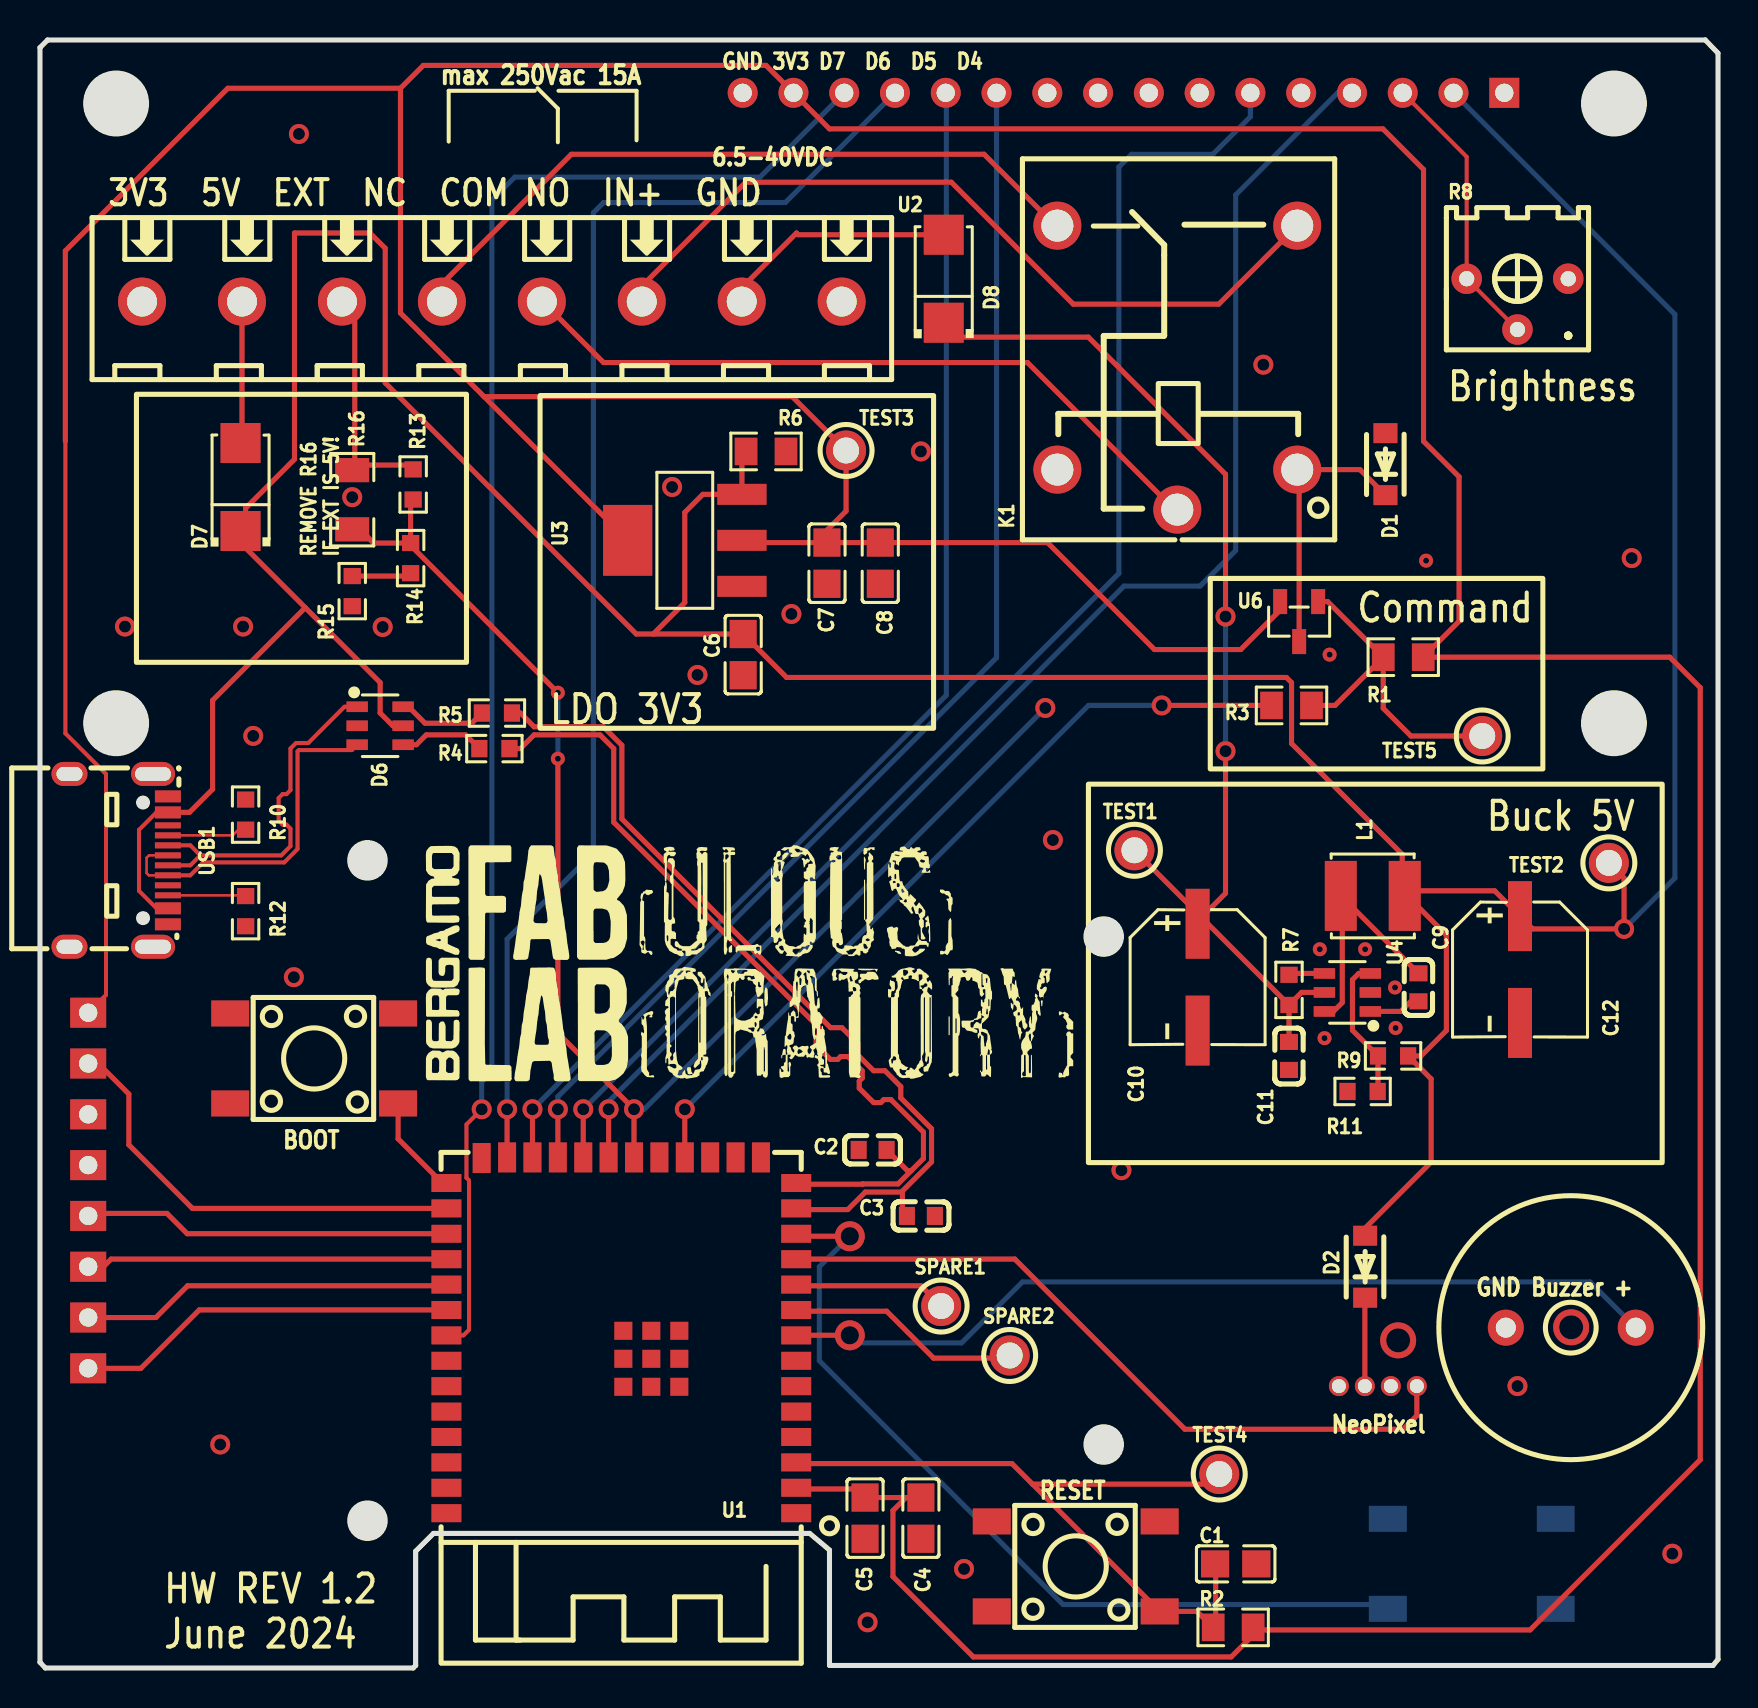
[diagram p4: board, top side]
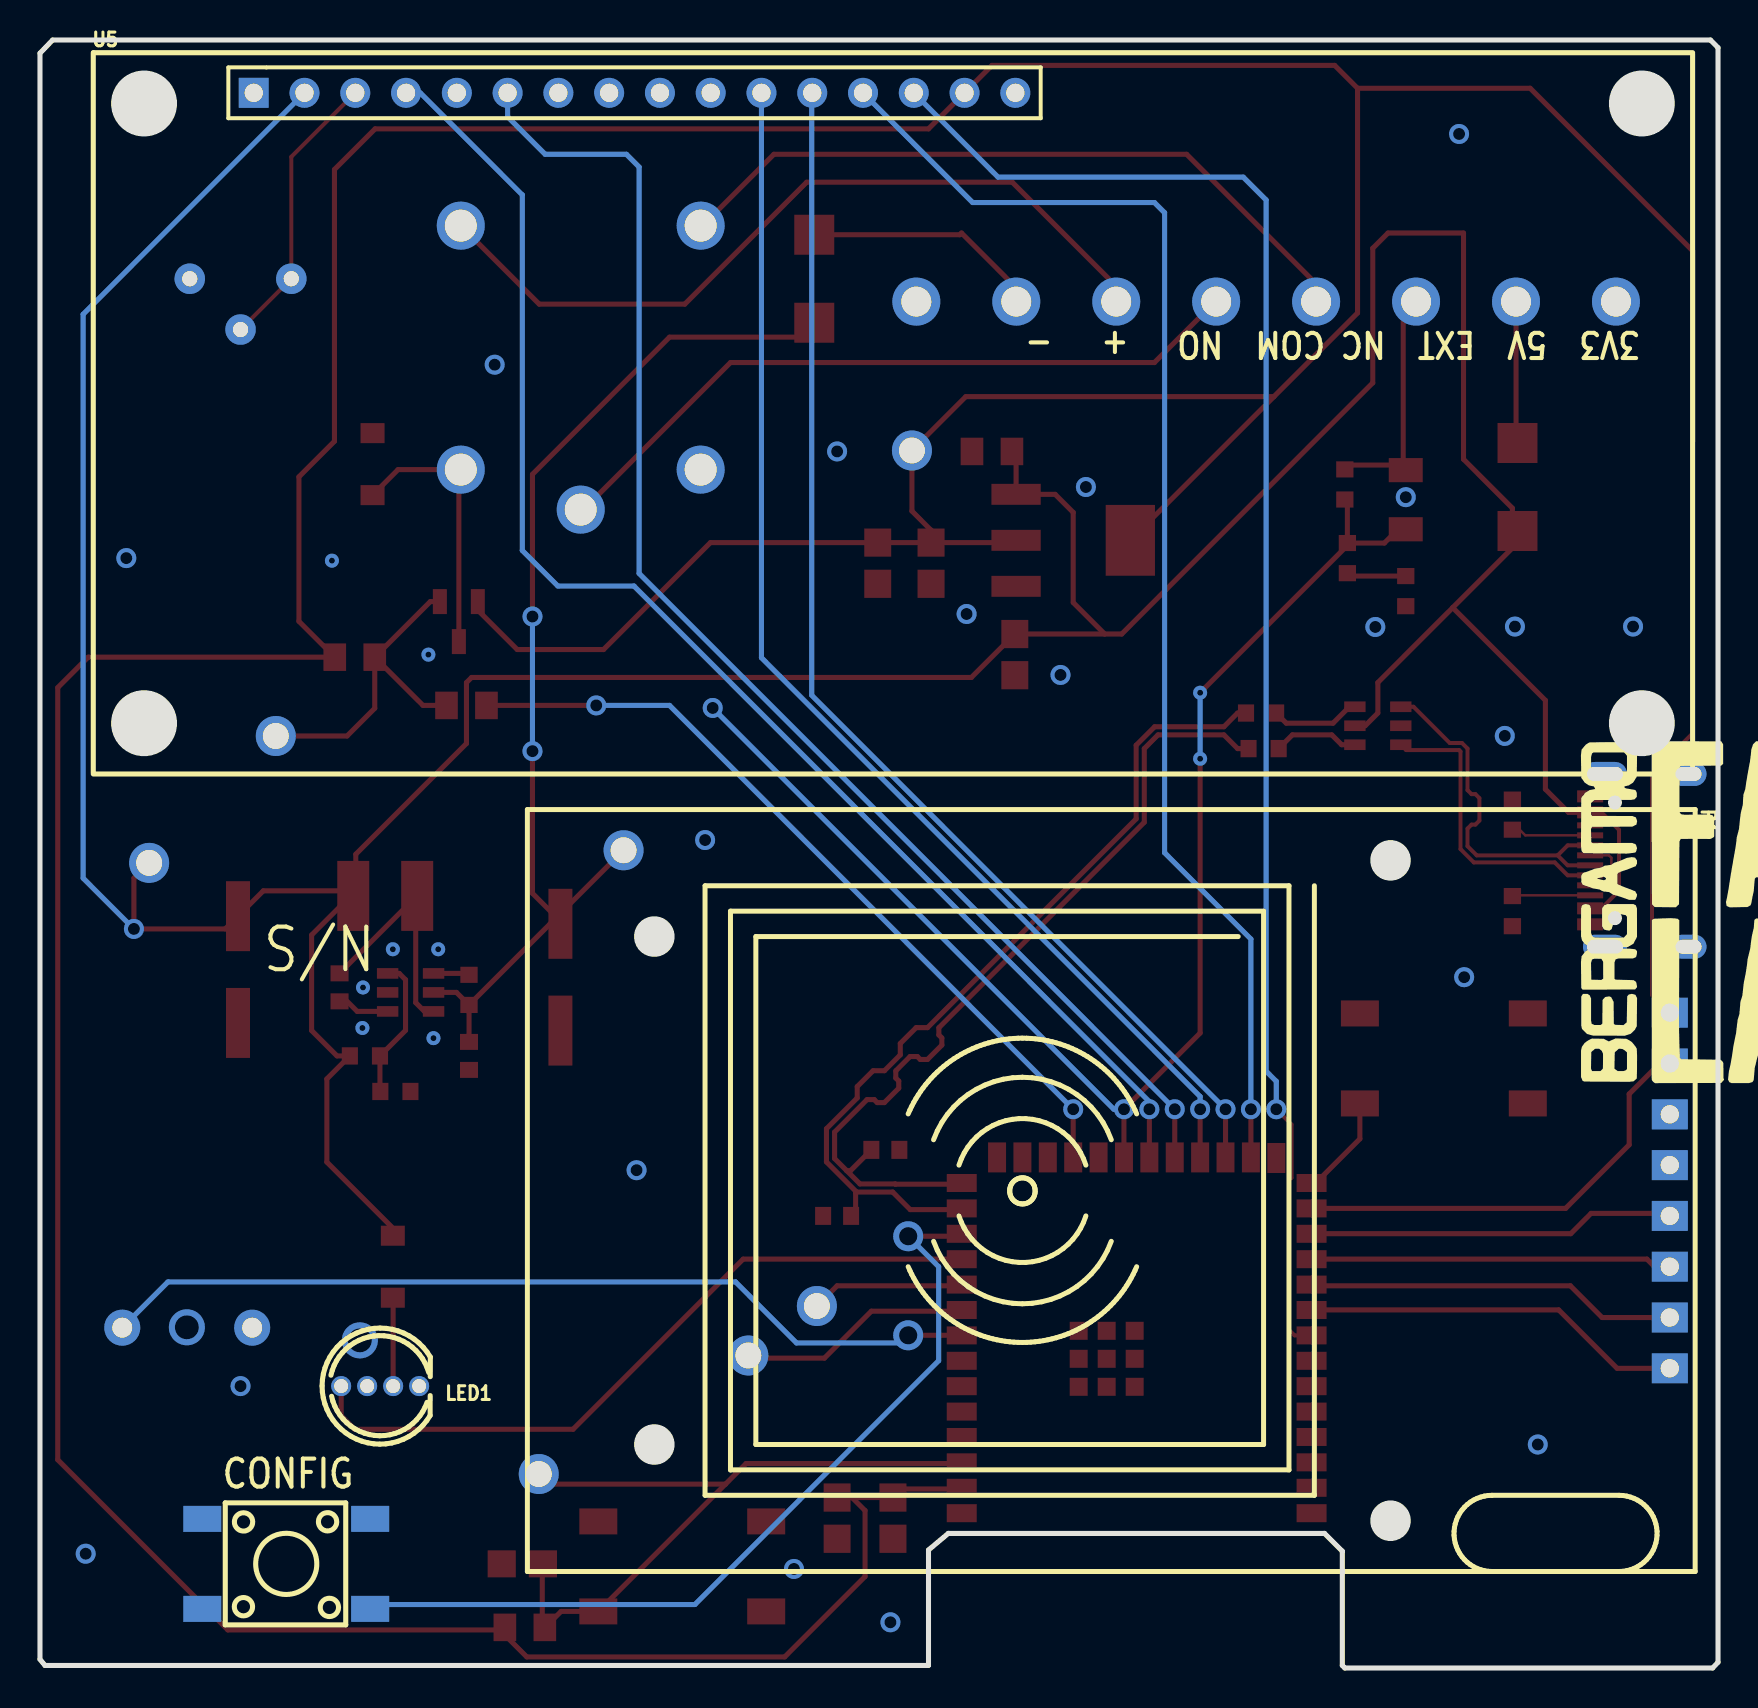
[diagram p5: board, bottom side, seen from below]

Outline 83.95 x 81.41 mm; copper layers: Top Layer, Bottom Layer. Coordinates in mm from the lower left corner of the outline.
Outline path: 0,81.03 0.38,81.41 83.31,81.41 83.95,80.75 83.95,0.43 83.7,0.13 39.62,0.13 39.5,0.13 39.5,5.9 38.51,6.73 19.69,6.73 18.8,5.84 18.8,0.13 18.67,0 0.27,0 0,0.29 0,81.03
Stack: Top Layer 0.035mm / Dielectric1 1.51mm FR4 er 4.5 / Bottom Layer 0.035mm

## Design rules (mm)
net USB-D+: DP2
net D+: DP1
net USB-D-: DP2
net D-: DP1
net DN: DP3
net DP: DP3
template: JLCPCB Capability(Two Layers Board)
spacing copperThickness1oz (default): track to track 0.102, other pairs 0.152 to 0.3
spacing copperThickness2oz: track to track 0.203, other pairs 0.152 to 0.3
track width copperThickness1oz (default): min 0.127, default 0.254, max 2.54
track width copperThickness2oz: min 0.203, default 0.254, max 2.54
differential pair differentialPair (default): width min 0.127, default 0.254, max 2.54; gap min 0.152, default 0.152
via viaSize (default): diameter min 0.5, default 0.61, max 10; hole min 0.3, default 0.305, max 6.3

## Placement (name value [footprint] x y rotation side)
BUZZER1  4kHz  [BUZ-TH_BD12.5-P6.50-D0.9]  76.58 17.02 180 top
C1  1uF  [C0805]  59.82 5.21 180 top
C2  22pF  [C0603]  41.66 25.91 0 top
C3  22pF  [C0603]  44.07 22.61 180 top
C4  10uF  [C0805]  44.07 7.49 90 top
C5  100nF  [C0805]  41.27 7.49 90 top
C6  1uF  [C0805]  35.18 50.67 270 top
C7  10uF  [C0805]  39.37 55.24 90 top
C8  100nF  [C0805]  42.04 55.24 90 top
C9  100nF  [C0603]  68.96 34.04 90 top
C10  22uF  [CAP-SMD_BD6.3-L6.6-W6.6-FD]  57.91 34.54 270 top
C11  100nF  [C0603]  62.48 30.61 90 top
C12  22uF  [CAP-SMD_BD6.3-L6.6-W6.6-FD]  74.04 34.92 270 top
D1  SM4007PL  [SOD-123F_L2.8-W1.8-LS3.7-RD]  67.31 60.2 90 top
D2  SM4007PL  [SOD-123F_L2.8-W1.8-LS3.7-RD]  66.29 20.07 90 top
D6  USBLC6-2SC6  [SOT-23-6_L2.9-W1.6-P0.95-LS2.8-BL]  17.02 47.12 270 top
D7  SS34  [SMA_L4.3-W2.6-LS5.2-RD]  10.03 59.05 90 top
D8  SS34  [SMA_L4.3-W2.6-LS5.2-RD]  45.21 69.47 90 top
K1  SRD-03VDC-SL-C  [RELAY-TH_SRD-03VDC-SL-C]  56.9 65.02 90 top
KEY1  TSA063G60-250  [KEY-SMD_4P-L6.1-W6.1-P4.50-LS9.0]  71.63 5.21 180 bottom
KEY2  TSA063G60-250  [KEY-SMD_4P-L6.1-W6.1-P4.50-LS9.0]  13.72 30.48 0 top
KEY3  TSA063G60-250  [KEY-SMD_4P-L6.1-W6.1-P4.50-LS9.0]  51.82 5.08 0 top
L1  10uH  [IND-SMD_L4.0-W4.0]  66.67 38.61 0 top
LED1  WS2812D-F5  [LED-TH_4P-BD5.8-P1.30]  66.93 14.1 180 bottom
P1  RFID  [footprint_17af]  16.26 30.35 270 bottom
R1  10kΩ  [R0805]  68.2 50.55 0 top
R2  10kΩ  [R0805]  59.69 2.03 0 top
R3  560Ω  [R0805]  62.61 48.13 180 top
R4  22Ω  [R0603]  22.73 45.97 180 top
R5  22Ω  [R0603]  22.86 47.75 180 top
R6  100kΩ  [R0805]  36.32 60.83 180 top
R7  100kΩ  [R0603]  62.48 33.91 90 top
R8  10kΩ  [RES-ADJ-TH_3362P]  73.91 68.2 180 top
R9  127kΩ  [R0603]  67.69 30.61 180 top
R10  5.1kΩ  [R0603]  10.29 42.67 90 top
R11  24kΩ  [R0603]  66.17 28.83 0 top
R12  5.1kΩ  [R0603]  10.29 37.85 90 top
R13  100kΩ  [R0603]  18.67 59.18 90 top
R14  100kΩ  [R0603]  18.54 55.5 90 top
R15  100kΩ  [R0603]  15.62 53.85 270 top
R16  0Ω  [R1206]  15.62 58.42 90 top
SPARE1  0577-0-43-80-21-27-10-0  [footprint_662d]  45.08 18.1 0 top
SPARE2  0577-0-43-80-21-27-10-0  [footprint_662d]  48.51 15.63 0 top
TEST1  0577-0-43-80-21-27-10-0  [footprint_662d]  54.75 40.89 0 top
TEST2  0577-0-43-80-21-27-10-0  [footprint_662d]  78.49 40.26 0 top
TEST3  0577-0-43-80-21-27-10-0  [footprint_662d]  40.33 60.88 0 top
TEST4  0577-0-43-80-21-27-10-0  [footprint_662d]  59 9.7 0 top
TEST5  0577-0-43-80-21-27-10-0  [footprint_662d]  72.15 46.6 0 top
U1  ESP32-S3-WROOM-1-N4R8  [wirelm-smd_esp32-s3-wroom-1]  29.08 16.64 180 top
U2  DB127V-5.0-8P-GN-S  [CONN-TH_8P-P5.00_DB127V-5.0-8P-GN-S]  22.61 68.33 180 top
U3  LD1117S33TR  [SOT-223_L6.5-W3.5-P2.30-LS7.0-BR]  32.26 56.39 0 top
U4  TP6841S6-A  [SOT-23-6_L2.9-W1.6-P0.95-LS2.8-BL]  65.41 33.78 90 top
U5  LCD-1602  [footprint_8a57]  50.8 64.77 180 bottom
U6  MMBT3906  [SOT-23-3_L2.9-W1.3-P1.90-LS2.4-BR]  62.99 52.32 90 top
USB1  U262-161N-4BVC11  [USB-3.1-SMD_U262-161N-4BVC11]  3.94 40.39 270 top

## Footprints (pads in the part's own frame, mm; a bottom-side part is the same pattern mirrored in y, then rotated)
BUZ-TH_BD12.5-P6.50-D0.9
  round 1.8 hole 1: 1(-3.25,0) 2(3.25,0)
C0603
  rect 0.8x0.9 smd: 1(-0.7,0) 2(0.7,0)
C0805
  rect 1.41x1.35 smd: 1(-1.03,0) 2(1.03,0)
CAP-SMD_BD6.3-L6.6-W6.6-FD
  rect 3.5x1.2 smd: 1(-2.67,0) 2(2.67,0)
CONN-TH_8P-P5.00_DB127V-5.0-8P-GN-S
  round 2.4 hole 1.5: 1(-17.5,0) 2(-12.5,0) 3(-7.5,0) 4(-2.5,0) 5(2.5,0) 6(7.5,0) 7(12.5,0) 8(17.5,0)
footprint_8a57
  rect 1.498x1.498 hole 0.914: 1(-22.453,13.995)
  round 1.498 hole 0.914: 2(-19.913,13.995) 3(-17.373,13.995) 4(-14.834,13.995) 5(-12.293,13.995) 6(-9.754,13.995) 7(-7.213,13.995) 8(-4.673,13.995) 9(-2.134,13.995) 10(0.406,13.995) 11(2.946,13.995) 12(5.487,13.995) 13(8.027,13.995) 14(10.566,13.995) 15(13.107,13.995) 16(15.646,13.995)
footprint_17af
  rect 1.5x1.8 hole 0.914: 1(15.367,13.844) 2(12.827,13.844) 3(10.287,13.844) 4(7.747,13.844) 5(5.207,13.844) 6(2.667,13.844) 7(0.127,13.844) 8(-2.413,13.844)
footprint_662d
  round 2 hole 1.3: 1(0,0)
IND-SMD_L4.0-W4.0
  rect 1.6x3.5 smd: 1(-1.6,0) 2(1.6,0)
KEY-SMD_4P-L6.1-W6.1-P4.50-LS9.0
  rect 1.9x1.3 smd: 1(-4.2,2.25) 2(4.2,2.25) 3(-4.2,-2.25) 4(4.2,-2.25)
LED-TH_4P-BD5.8-P1.30
  round 1 hole 0.7: 1(1.95,0) 2(0.65,0) 3(-0.65,0) 4(-1.95,0)
R0603
  rect 0.806x0.864 smd: 1(-0.753,0) 2(0.753,0)
R0805
  rect 1.133x1.377 smd: 1(-1,0) 2(1,0)
R1206
  rect 1.208x1.701 smd: 1(-1.479,0) 2(1.479,0)
RELAY-TH_SRD-03VDC-SL-C
  round 2.4 hole 1.6: 1(-5.1,-6) 2(7.1,-6) 3(7.1,6) 4(-5.1,6) 5(-7.1,0)
RES-ADJ-TH_3362P
  round 1.524 hole 0.762: 1(-2.54,-1.27) 2(0,1.27) 3(2.54,-1.27)
SMA_L4.3-W2.6-LS5.2-RD
  rect 2x2 smd: 1(-2.2,0) 2(2.2,0)
SOD-123F_L2.8-W1.8-LS3.7-RD
  rect 1x1.2 smd: 1(-1.55,0) 2(1.55,0)
SOT-23-3_L2.9-W1.3-P1.90-LS2.4-BR
  rect 1.25x0.7 smd: 1(1,-0.95) 2(1,0.95) 3(-1,0)
SOT-23-6_L2.9-W1.6-P0.95-LS2.8-BL
  rect 0.532x1.072 smd: 1(-0.95,-1.149) 2(0,-1.149) 3(0.95,-1.149) 4(0.95,1.149) 5(0,1.149) 6(-0.95,1.149)
SOT-223_L6.5-W3.5-P2.30-LS7.0-BR
  rect 2.465x1.05 smd: 1(2.857,-2.3) 2(2.857,0) 3(2.857,2.3)
  rect 2.465x3.54 smd: 4(-2.857,0)
USB-3.1-SMD_U262-161N-4BVC11
  rect 0.6x1.3 smd: A1B12(-3.2,2.462) A4B9(-2.4,2.462) B1A12(3.2,2.462) B4A9(2.4,2.462)
  rect 0.3x1.3 smd: A5(-1.25,2.462) A6(-0.25,2.462) A7(0.25,2.462) A8(1.25,2.462) B5(1.75,2.462) B6(0.75,2.462) B7(-0.75,2.462) B8(-1.75,2.462)
  oval 1.2x2.2 hole 0.7x1.8: SHELL(-4.32,1.719) SHELL(4.32,1.719)
  oval 1.2x1.8 hole 0.7x1.3: SHELL(-4.32,-2.462) SHELL(4.32,-2.462)
wirelm-smd_esp32-s3-wroom-1
  rect 1.5x0.9 smd: 1(-8.75,8.895) 2(-8.75,7.625) 3(-8.75,6.355) 4(-8.75,5.085) 5(-8.75,3.815) 6(-8.75,2.545) 7(-8.75,1.275) 8(-8.75,0.005) 9(-8.75,-1.265) 10(-8.75,-2.535) 11(-8.75,-3.805) 12(-8.75,-5.075) 13(-8.75,-6.345) 14(-8.75,-7.615) 27(8.75,-7.615) 28(8.75,-6.345) 29(8.75,-5.075) 30(8.75,-3.805) 31(8.75,-2.535) 32(8.75,-1.265) 33(8.75,0.005) 34(8.75,1.275) 35(8.75,2.545) 36(8.75,3.815) 37(8.75,5.085) 38(8.75,6.355) 39(8.75,7.625) 40(8.75,8.895)
  rect 0.9x1.5 smd: 15(-6.985,-8.895) 16(-5.715,-8.895) 17(-4.445,-8.895) 18(-3.175,-8.895) 19(-1.905,-8.895) 20(-0.635,-8.895) 21(0.635,-8.895) 22(1.905,-8.895) 23(3.175,-8.895) 24(4.445,-8.895) 25(5.715,-8.895) 26(6.985,-8.865)
  rect 0.9x0.9 smd: 41(-2.9,2.575) 41(-2.9,1.175) 41(-2.9,-0.225) 41(-1.5,2.575) 41(-1.5,1.175) 41(-1.5,-0.225) 41(-0.1,2.575) 41(-0.1,1.175) 41(-0.1,-0.225)

## Nets
As in the schematic.

Pads without a net: KEY1 1 3; KEY2 1 3; KEY3 3; LED1 1; P1 5; U1 4 5 6 7 15 16 17 19 26 34 35 36 37 38 39; U2 8; U5 7 8 9 10; USB1 A8 B8

## Via types
v1: diameter 1, hole 0.6, Top Layer to Bottom Layer, 33 vias
v2: diameter 1.8, hole 1.2, Top Layer to Bottom Layer, 2 vias
v3: diameter 0.7, hole 0.3, Top Layer to Bottom Layer, 9 vias
v4: diameter 1.499, hole 0.914, Top Layer to Bottom Layer, 2 vias

## Routing (per net, layer and track width the routed paths; a pad name or vN(x,y) marks a point on that pad's centre or on a via; arc(x,y) is an arc through that point)
3V3: length 330.2
  Top Layer w0.2: P1.8 3.3,33.66 3.3,44.7 1.27,46.74 1.27,61.34
  Top Layer w0.254: U6.2 62.04,52.9 60.07,50.93 55.75,50.93 50.41,56.27 C8.2 C7.2 ; 1.27,61.34 1.27,70.87 9.4,78.99 18.03,78.99 ; 18.03,78.99 19.18,80.14 36.32,80.14 U5.15 39.5,76.96 67.18,76.96 69.22,74.93 69.22,61.34 70.99,59.56 70.99,52.34 R1.2 81.53,50.55 83.06,49.02 83.06,10.41 74.55,1.91 60.94,1.91 59.59,0.55 46.69,0.55 42.67,4.57 42.67,7.87 43.32,8.52 ; 18.03,78.99 18.03,67.75 22.22,63.57 ; 43.32,8.52 C5.2 ; 43.32,8.52 C4.2 ; 40.78,8.89 40.72,8.95 37.98,8.95 ; C7.2 39.37,56.9 40.33,57.85 TEST3.1 37.63,63.57 22.22,63.57 ; C7.2 35.23,56.27 U3.2 ; 22.22,63.57 U3.4
5V: length 222.1
  Top Layer w0.2: 6.53,42.79 5.83,42.79 4.95,41.91 4.95,38.86 5.83,37.99 6.53,37.99
  Top Layer w0.254: 68.15,38.86 72.77,38.86 C12.1 74.68,36.96 v1(79.25,36.96) 79.25,39.5 TEST2.1 ; 68.15,38.86 68.15,40.69 62.61,46.23 62.61,49.28 62.36,49.53 37.35,49.53 C6.1 30.68,51.7 ; 68.15,38.86 70.36,36.65 70.36,31.88 69.09,30.61 R9.1 69.6,29.46 69.6,25.3 66.17,21.87 66.17,21.49 ; 30.68,51.7 29.83,51.7 17.27,64.26 17.27,70.99 16.51,71.75 12.73,71.75 12.73,60.44 10.29,58 10.29,56.01 13.27,53.02 ; 30.68,51.7 32.26,53.28 32.26,57.78 33.16,58.69 U3.3 35.12,60.63 R6.2 ; D6.5 17.65,47.12 17.02,47.75 17.02,49.28 13.27,53.02 ; 13.27,53.02 8.64,48.39 8.64,43.94 7.48,42.79 6.53,42.79
  Bottom Layer w0.254: v1(79.25,36.96) 81.79,39.5 81.79,67.69 U5.2
GND:
  vias: v1(4.25,52.08) v1(9.02,11.18) v1(10.16,52.08) v1(10.67,46.61) v1(12.7,34.54) v1(12.95,76.71) v1(17.15,52.06) v1(31.62,59.05) v1(32.89,49.66) v1(37.59,52.7) v1(41.4,2.29) v1(44.07,60.83) v1(46.23,4.95) v1(50.67,41.4) v1(54.1,24.89) v1(61.2,65.17) v1(73.91,14.1) v1(79.63,55.5) v1(81.66,5.72) v3(64.03,35.94) v3(64.26,31.5) v3(64.52,50.67) v3(66.29,35.94) v3(67.79,34.03) v3(67.82,32) v3(69.34,55.37)
(no net):
  vias: v1(15.62,58.55) v2(67.95,16.38) v2(76.6,17.04)
BOOT: length 5
  Top Layer w0.254: KEY2.4 17.92,26.46 20.18,24.19
BUZ: length 44.2
  Top Layer w0.254: 37.98,16.57 38.05,16.64 v4(40.51,16.64)
  Bottom Layer w0.254: BUZZER1.1 77.55,19.3 49.15,19.3 46.1,16.26 40.89,16.26 v4(40.51,16.64)
CMD: length 40.1
  Top Layer w0.254: R3.2 v1(56.12,48.13) ; 32.26,25.59 v1(32.26,27.94)
  Bottom Layer w0.254: v1(32.26,27.94) 52.45,48.13 v1(56.12,48.13)
CONFIG: length 43.8
  Top Layer w0.254: v4(40.51,21.59) 38.05,21.59 37.98,21.65
  Bottom Layer w0.254: 68.19,2.96 67.97,3.17 51.18,3.17 38.99,15.37 38.99,20.07 v4(40.51,21.59)
D+: length 42.8
  Top Layer w0.254: 37.98,24.19 41.15,24.19 41.16,24.21 42.93,24.21 43.59,24.87 ; C2.2 43.4,24.87 43.59,24.87 ; 43.59,24.87 44.2,25.48 44.2,26.8 42.57,28.42 42.21,28.42 42.06,28.27 41.7,28.27 40.99,28.99 40.99,29.35 41.13,29.5 41.13,29.86 40.42,30.58 40.06,30.58 39.91,30.43 39.55,30.43 38.83,31.15 38.83,31.51 38.98,31.65 38.98,32.01 28.7,42.29 28.7,45.97 28.02,46.66 24.72,46.66 24.03,45.97 R4.1
D-: length 42.6
  Top Layer w0.254: 43.09,23.8 43.14,23.75 43.14,22.86 ; 43.09,23.8 44.6,25.31 44.6,26.97 43.06,28.5 43.06,29.07 42.27,29.87 41.7,29.87 40.91,30.66 40.91,31.23 40.11,32.02 39.55,32.02 29.11,42.46 29.11,46.14 28.18,47.07 24.72,47.07 24.03,47.75 R5.1 ; 43.09,23.8 41.29,23.8 40.41,22.92 37.98,22.92
DN: length 17.9
  Top Layer w0.2: 8.02,40.63 7.52,40.14 6.53,40.14 ; 8.02,40.63 7.52,41.14 6.53,41.14 ; 8.02,40.63 12.07,40.63 12.53,41.1 12.53,41.97 12.33,42.17 12.14,42.17 11.94,42.37 11.94,43.5 12.14,43.7 12.33,43.7 12.53,43.9 12.53,45.98 12.81,46.25 13.42,46.25 15.23,48.07 D6.1
DP: length 18.2
  Top Layer w0.127: 6.53,40.64 5.46,40.64 5.33,40.51 5.33,39.75 5.45,39.64 6.53,39.64
  Top Layer w0.2: D6.3 15.6,45.9 12.95,45.9 12.88,45.83 12.88,40.95 12.22,40.28 8.17,40.28 7.52,39.64 6.53,39.64
IO16: length 11.6
  Top Layer w0.254: 37.98,17.84 42.36,17.84 44.7,15.49 48.38,15.49 SPARE2.1
IO17: length 7.5
  Top Layer w0.254: SPARE1.1 44.07,19.11 37.98,19.11
LCD_D4: length 62.3
  Top Layer w0.254: 25.91,25.59 v1(25.91,27.94)
  Bottom Layer w0.254: v1(25.91,27.94) 25.91,28.57 47.85,50.52 U5.11
LCD_D5: length 61.8
  Top Layer w0.254: 24.64,25.59 v1(24.64,27.94)
  Bottom Layer w0.254: v1(24.64,27.94) 45.34,48.64 45.34,78.74 U5.12
LCD_D6: length 66.5
  Top Layer w0.254: 23.37,25.59 v1(23.37,27.94)
  Bottom Layer w0.254: v1(23.37,27.94) 23.37,36.45 27.69,40.77 27.69,72.77 28.19,73.28 37.29,73.28 U5.13
LCD_D7: length 78.2
  Top Layer w0.2: v1(22.1,27.94) 21.34,27.18 21.33,24.51 21.46,24.38 21.46,16.91 21.18,16.63 U1.33
  Bottom Layer w0.254: U5.14 36.02,74.55 23.75,74.55 22.61,73.41 22.61,29.84 22.1,29.34 v1(22.1,27.94)
LCD_EN: length 69.4
  Top Layer w0.254: 27.18,25.59 v1(27.18,27.94)
  Bottom Layer w0.254: U5.6 60.55,77.57 58.67,75.69 54.61,75.69 53.98,75.06 53.98,54.74 v1(27.18,27.94)
LCD_RS: length 71.2
  Top Layer w0.254: 28.45,25.59 v1(28.45,27.94)
  Bottom Layer w0.254: U5.4 64.92,78.77 59.82,73.66 59.82,55.88 58.04,54.1 54.23,54.1 28.45,28.32 v1(28.45,27.94)
MCU_RESET: length 37.4
  Top Layer w0.254: 49.65,9.19 KEY3.4 57.88,2.83 58.82,1.89 58.82,5.18 C1.2 ; 49.65,9.19 48.62,10.22 37.98,10.22 ; 49.65,9.19 58.36,9.19 59.12,9.95
NEO: length 36.2
  Top Layer w0.254: LED1.4 68.88,12.62 68.2,11.94 57.28,11.94 48.77,20.45 38.05,20.45 37.98,20.38
OUT_COMMON: length 37
  Top Layer w0.254: K1.5 56.76,57.92 49.4,65.28 28.19,65.28 25.11,68.37 25.11,69.21
OUT_NC: length 35
  Top Layer w0.254: K1.3 50.8,72.12 47.23,75.69 26.58,75.69 20.11,69.21
OUT_NO: length 39
  Top Layer w0.254: 30.11,69.21 30.23,69.21 35.31,74.29 45.59,74.29 51.69,68.2 58.97,68.2 K1.2
POW+: length 54.4
  Top Layer w0.254: 57.91,37.34 57.79,37.21 C10.1 58.43,37.21 R7.1 ; 57.91,37.34 59.31,38.74 v1(59.31,45.85) ; 57.91,37.34 57.91,37.73 TEST1.1 ; 45.93,66.55 52.45,66.55 59.31,59.69 v1(59.31,52.58) ; U4.5 63.11,33.78 R7.1 ; R7.1 C11.2
  Bottom Layer w0.254: v1(59.31,45.85) v1(59.31,52.58)
RFID_MISO: length 18.3
  Top Layer w0.254: 20.18,21.65 20.12,21.72 7.37,21.72 6.35,22.73 2.67,22.73 2.41,22.99
RFID_MOSI: length 18
  Top Layer w0.254: P1.3 3.18,20.07 3.56,20.45 20.08,20.45 20.21,20.32
RFID_RST: length 22.5
  Top Layer w0.254: 2.41,30.73 4.45,28.7 4.45,26.16 7.62,22.98 20.12,22.98 20.18,22.92
RFID_SCK: length 18.6
  Top Layer w0.254: 2.41,17.91 2.79,17.53 5.8,17.53 7.39,19.11 20.18,19.11
RFID_SDA: length 19.2
  Top Layer w0.254: 20.18,17.84 20.12,17.91 7.97,17.91 5.05,14.99 2.79,14.99 2.41,15.37
SPARE3: length 69.6
  Top Layer w0.254: R14.2 18.54,58.3 R13.1 ; R14.2 18.54,56.13 v3(25.91,48.77) ; R14.2 16.69,56.25 15.75,57.19 ; v3(25.91,45.47) 25.91,31.75 v1(29.72,27.94) 29.72,25.59
  Bottom Layer w0.254: v1(29.72,27.94) 30.23,27.94 v1(50.29,48.01) ; v3(25.91,45.47) v3(25.91,48.77)
USB-D+: length 4.3
  Top Layer w0.254: R4.2 21.29,46.66 19.32,46.66 18.83,46.17 D6.4
USB-D-: length 4.5
  Top Layer w0.254: D6.6 18.44,48.07 19.26,47.24 21.6,47.24 R5.2
$1N85: length 13.6
  Top Layer w0.254: D1.1 66.03,59.92 K1.1 62.99,59.83 U6.3
$1N86: length 17.1
  Top Layer w0.254: R3.1 64.79,48.13 R1.1 ; R1.1 64.42,53.32 U6.1 ; R1.1 67.2,47.99 68.58,46.6 TEST5.1
$1N90: length 4.7
  Top Layer w0.254: 66.19,18.8 66.28,18.71 LED1.2
$1N15737: length 2.2
  Top Layer w0.254: U4.1 68.08,32.83 68.58,33.34
$1N15956: length 1.8
  Top Layer w0.254: U4.4 62.55,34.73 R7.2
$1N24952: length 3.8
  Top Layer w0.127: R12.2 10.25,38.64 6.53,38.64
$1N25390: length 3.9
  Top Layer w0.127: R10.1 9.92,41.92 9.64,41.64 6.53,41.64
$1N26975: length 14.2
  Top Layer w0.2: R8.2 R8.3 71.37,75.56 U5.3
$1N52138: length 11.8
  Top Layer w0.254: 65.15,38.26 65.29,38.41 C9.2 ; 65.15,38.26 65.15,38.53 L1.1 ; 65.15,38.26 65.15,33.27 64.71,32.83 U4.6
$1N52395: length 7.1
  Top Layer w0.254: U4.3 65.97,34.73 65.66,34.42 65.66,31.89 R9.2 66.94,28.85 R11.2
$1N56060: length 11.5
  Top Layer w0.254: R13.2 18.45,60.15 15.75,60.15 15.75,67.68 U2.6
$1N59600: length 3
  Top Layer w0.254: R14.1 18.4,54.6 R15.1
$1N59649: length 7.1
  Top Layer w0.254: D7.2 10.11,61.33 U2.7
$1N59700: length 12
  Top Layer w0.254: U2.2 35.11,69.01 37.85,71.75 37.93,71.67 D8.2

## Copper pours and planes (outline as drawn; the poured copper is in the pictures)
GND on Top Layer: 0.13,81.22 83.82,81.22 83.82,0.14 0.13,0.14
GND on Bottom Layer: -0.25,81.53 83.57,81.53 83.57,-0.51 -0.25,-0.51

## Text on the board
Bottom Silkscreen Layer: 3V3  5V  EXT  NC COM  NO   +   - | CONFIG | S/N
Top Silkscreen Layer: REMOVE R16 / IF EXT IS 5V! | GND 3V3 D7  D6  D5  D4 | BOOT | 6.5-40VDC | RESET | NeoPixel | GND Buzzer + | max 250Vac 15A | 3V3  5V  EXT  NC  COM NO  IN+  GND | LDO 3V3 | Command | Brightness | Buck 5V | HW REV 1.2 / June 2024
